# EAGLE board IR_CHR_LINSW_J002947Arevs (EAGLE 6.4), part 1 of 3
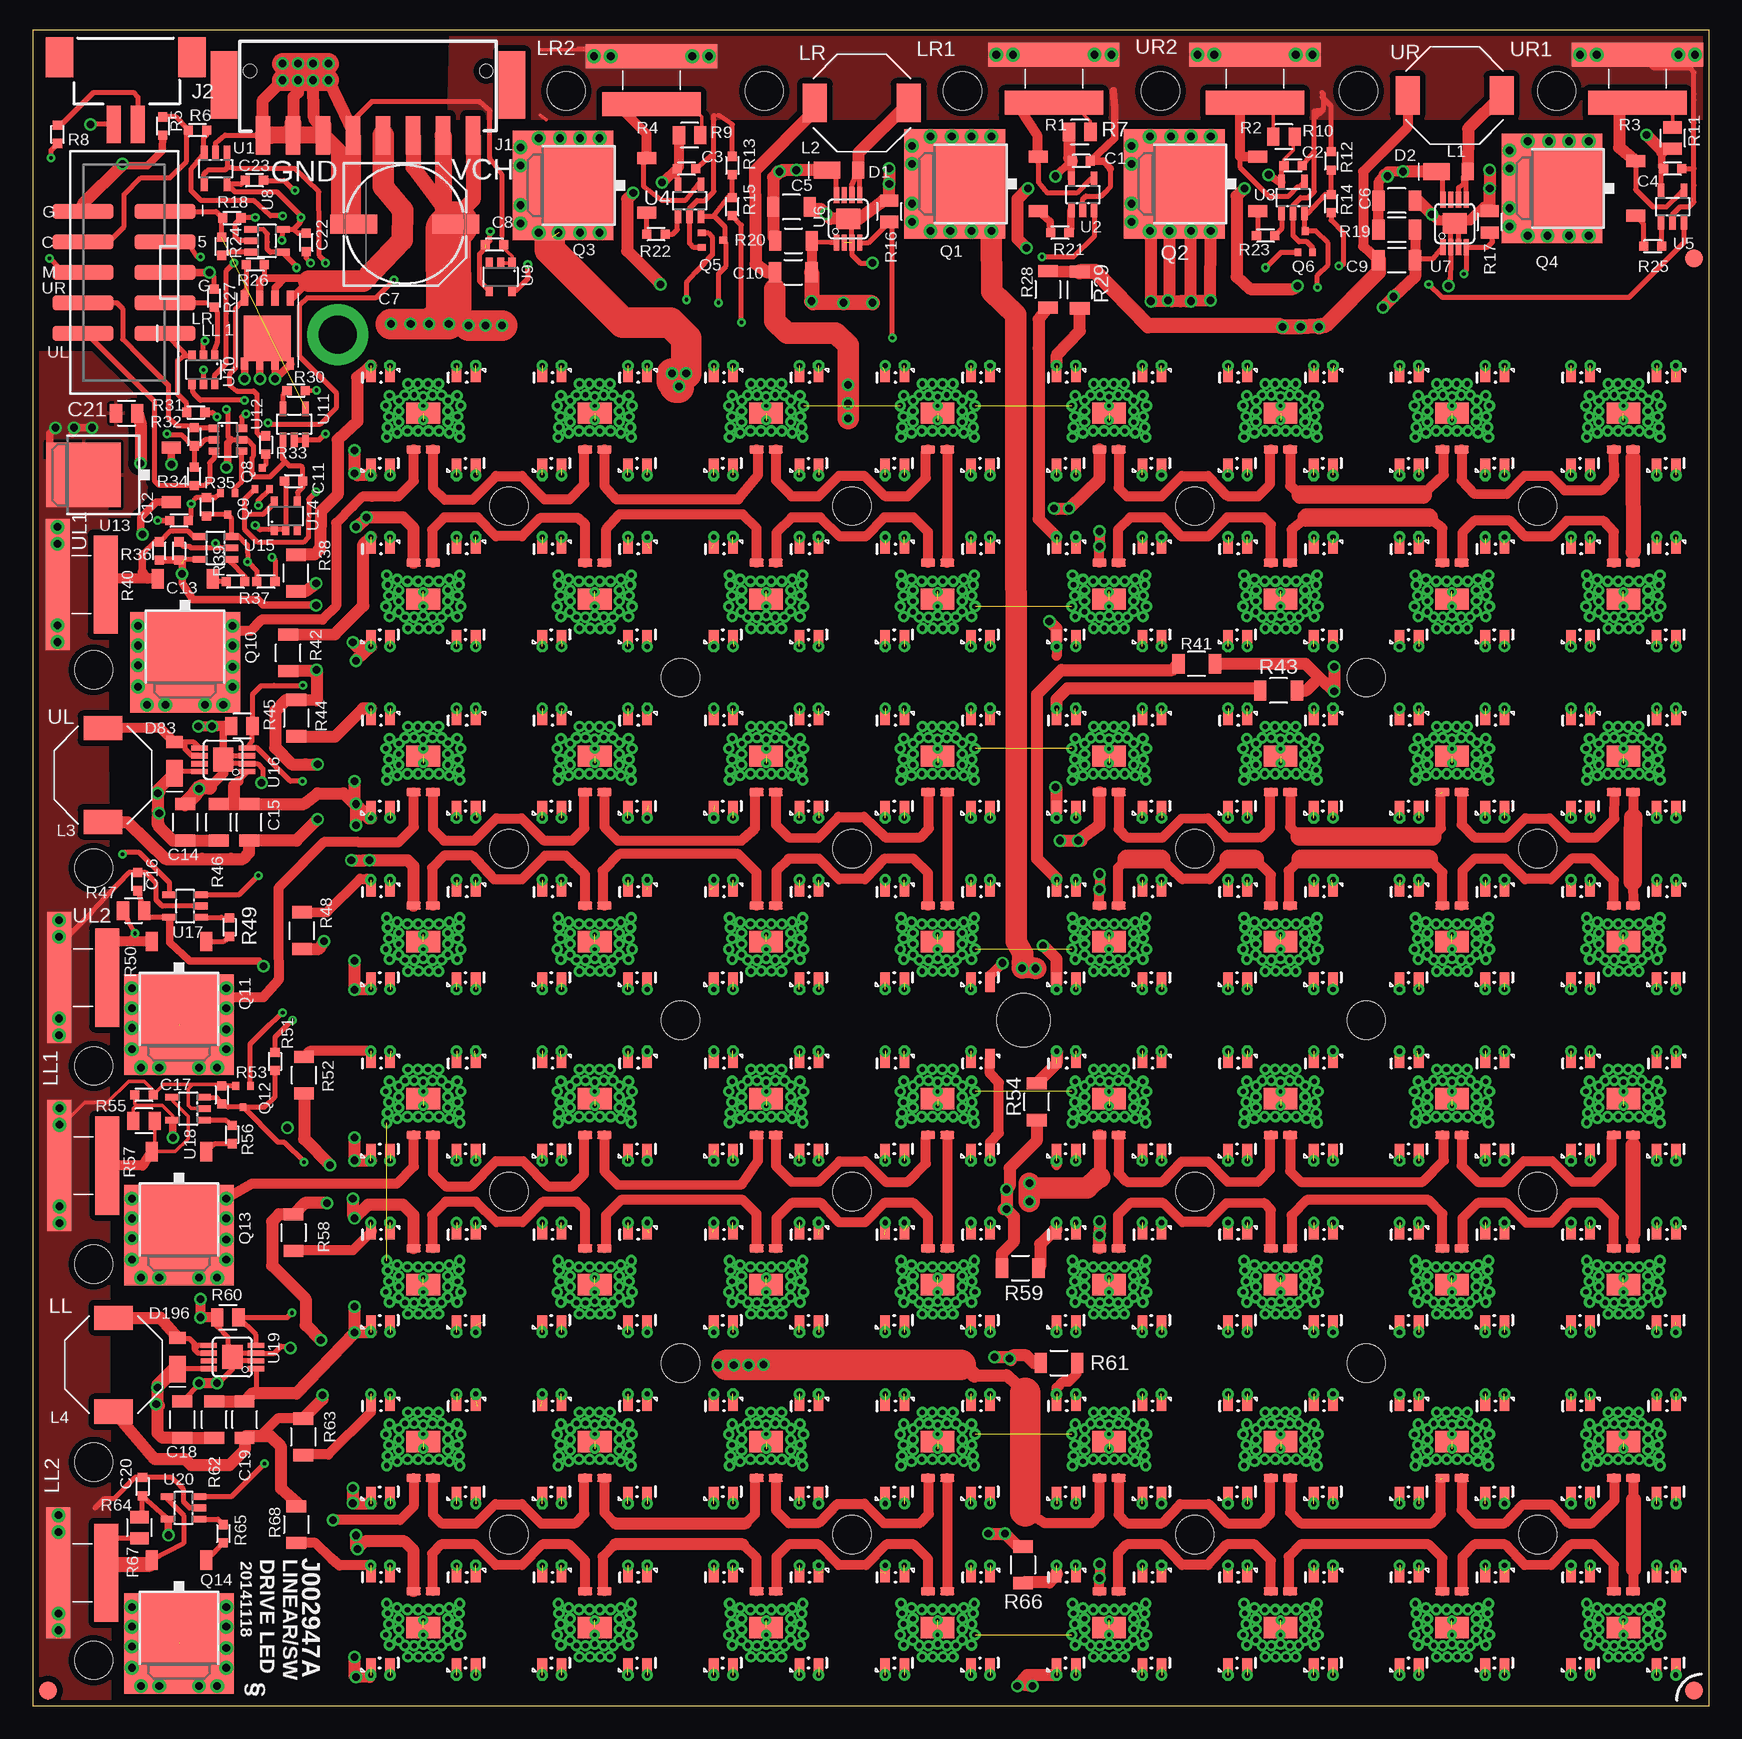
[diagram p5: board, top side]
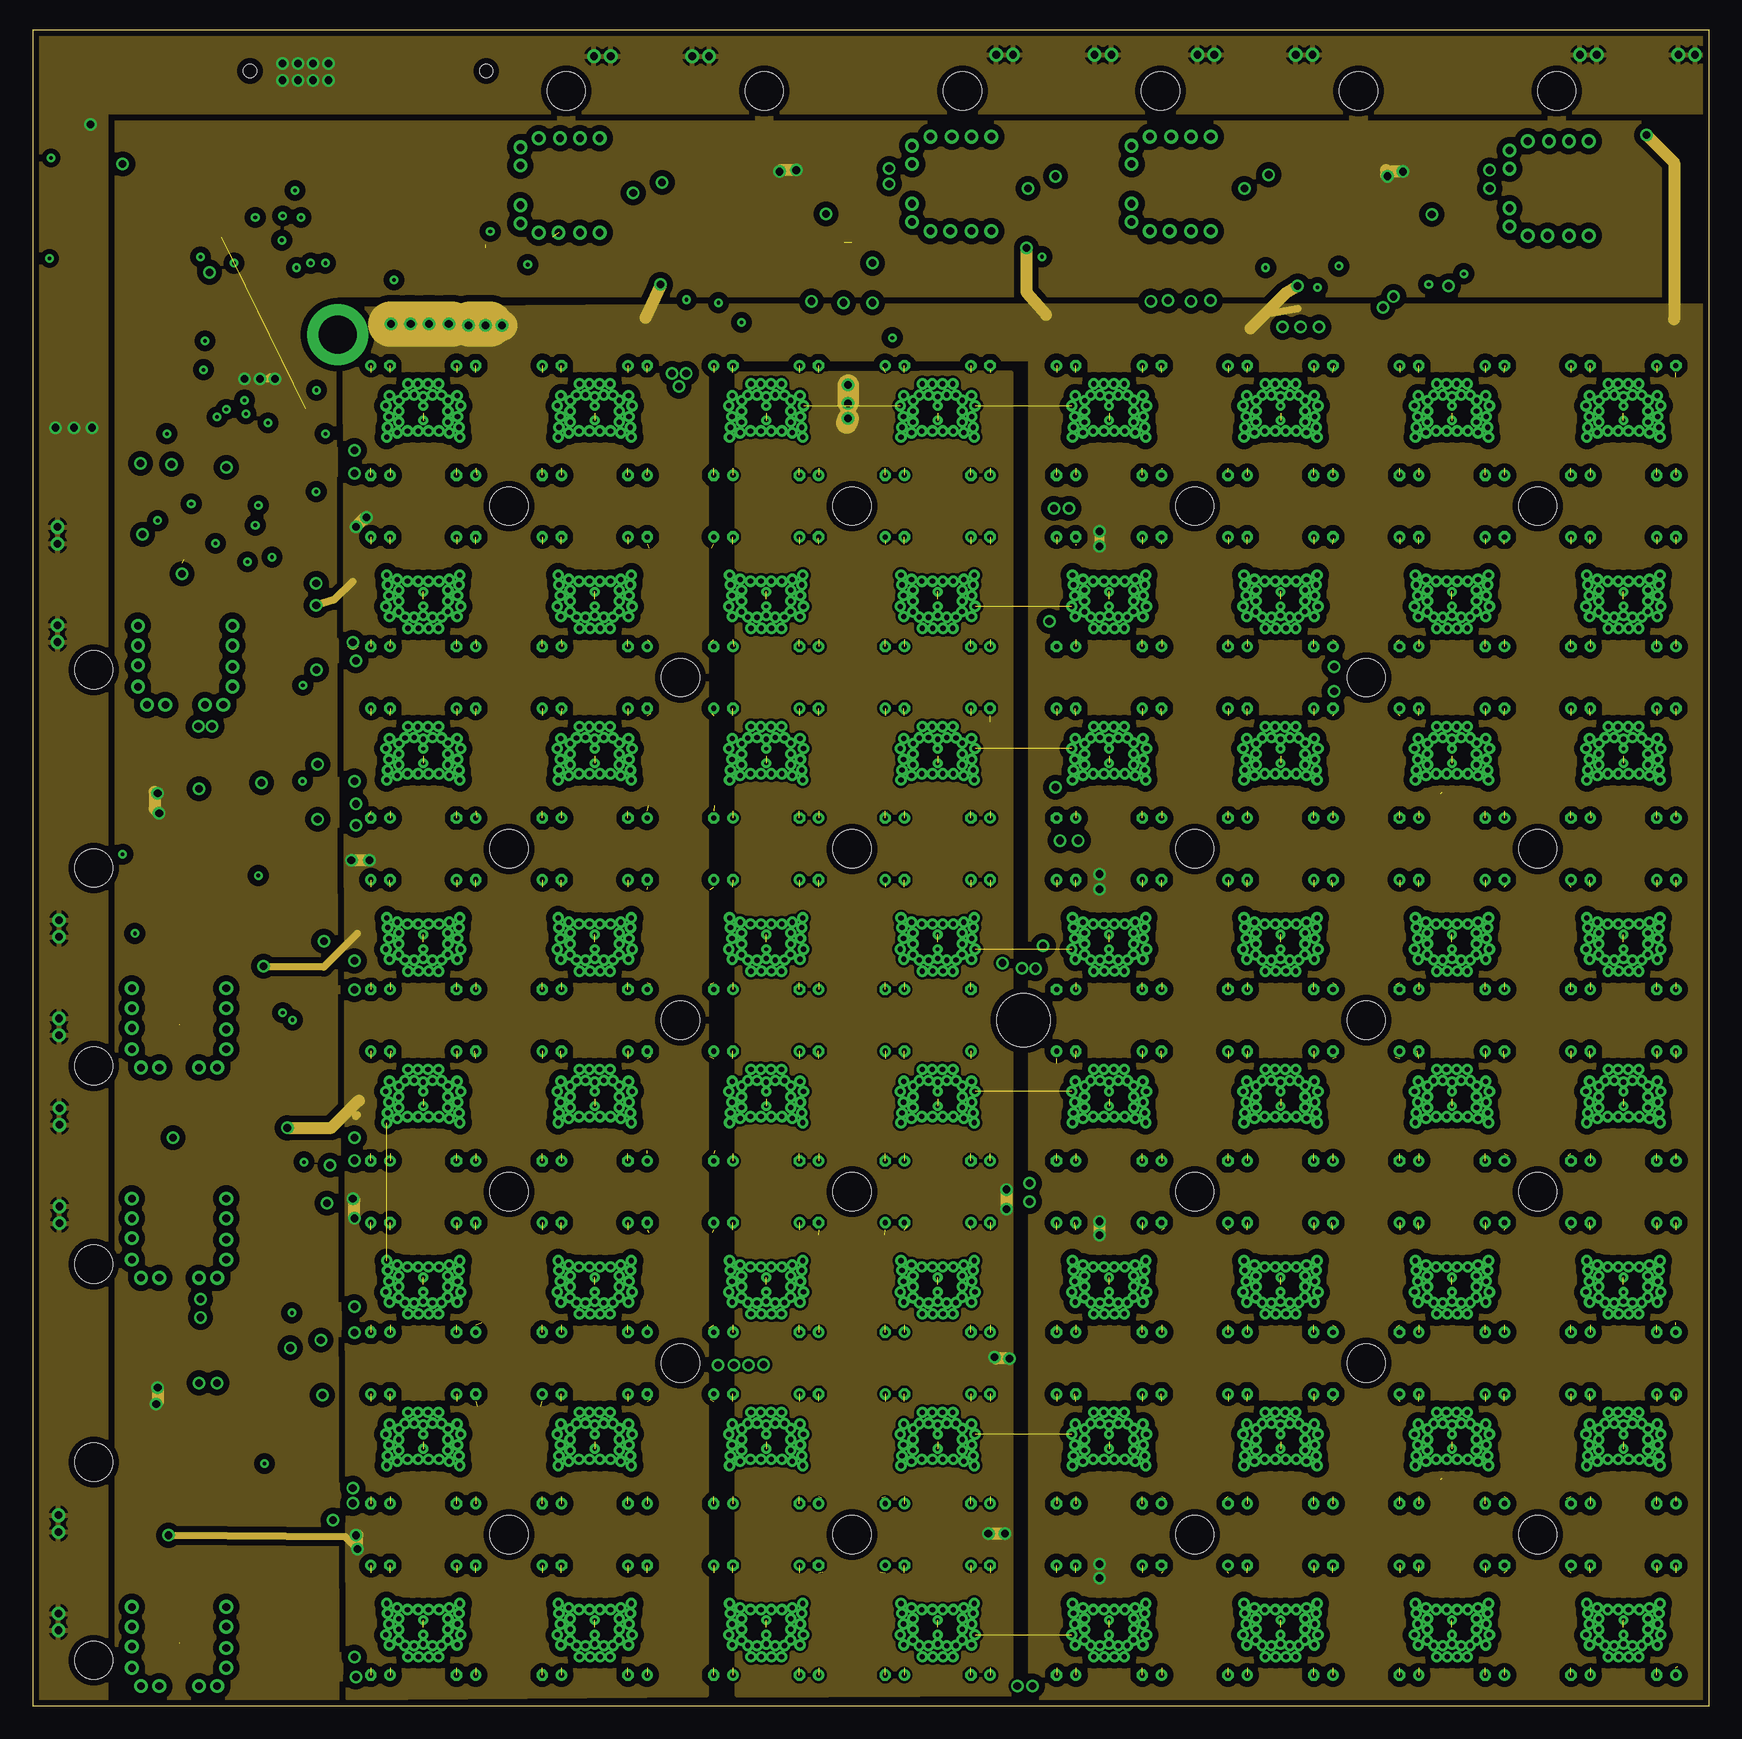
[diagram p6: board, inner layer Route2]
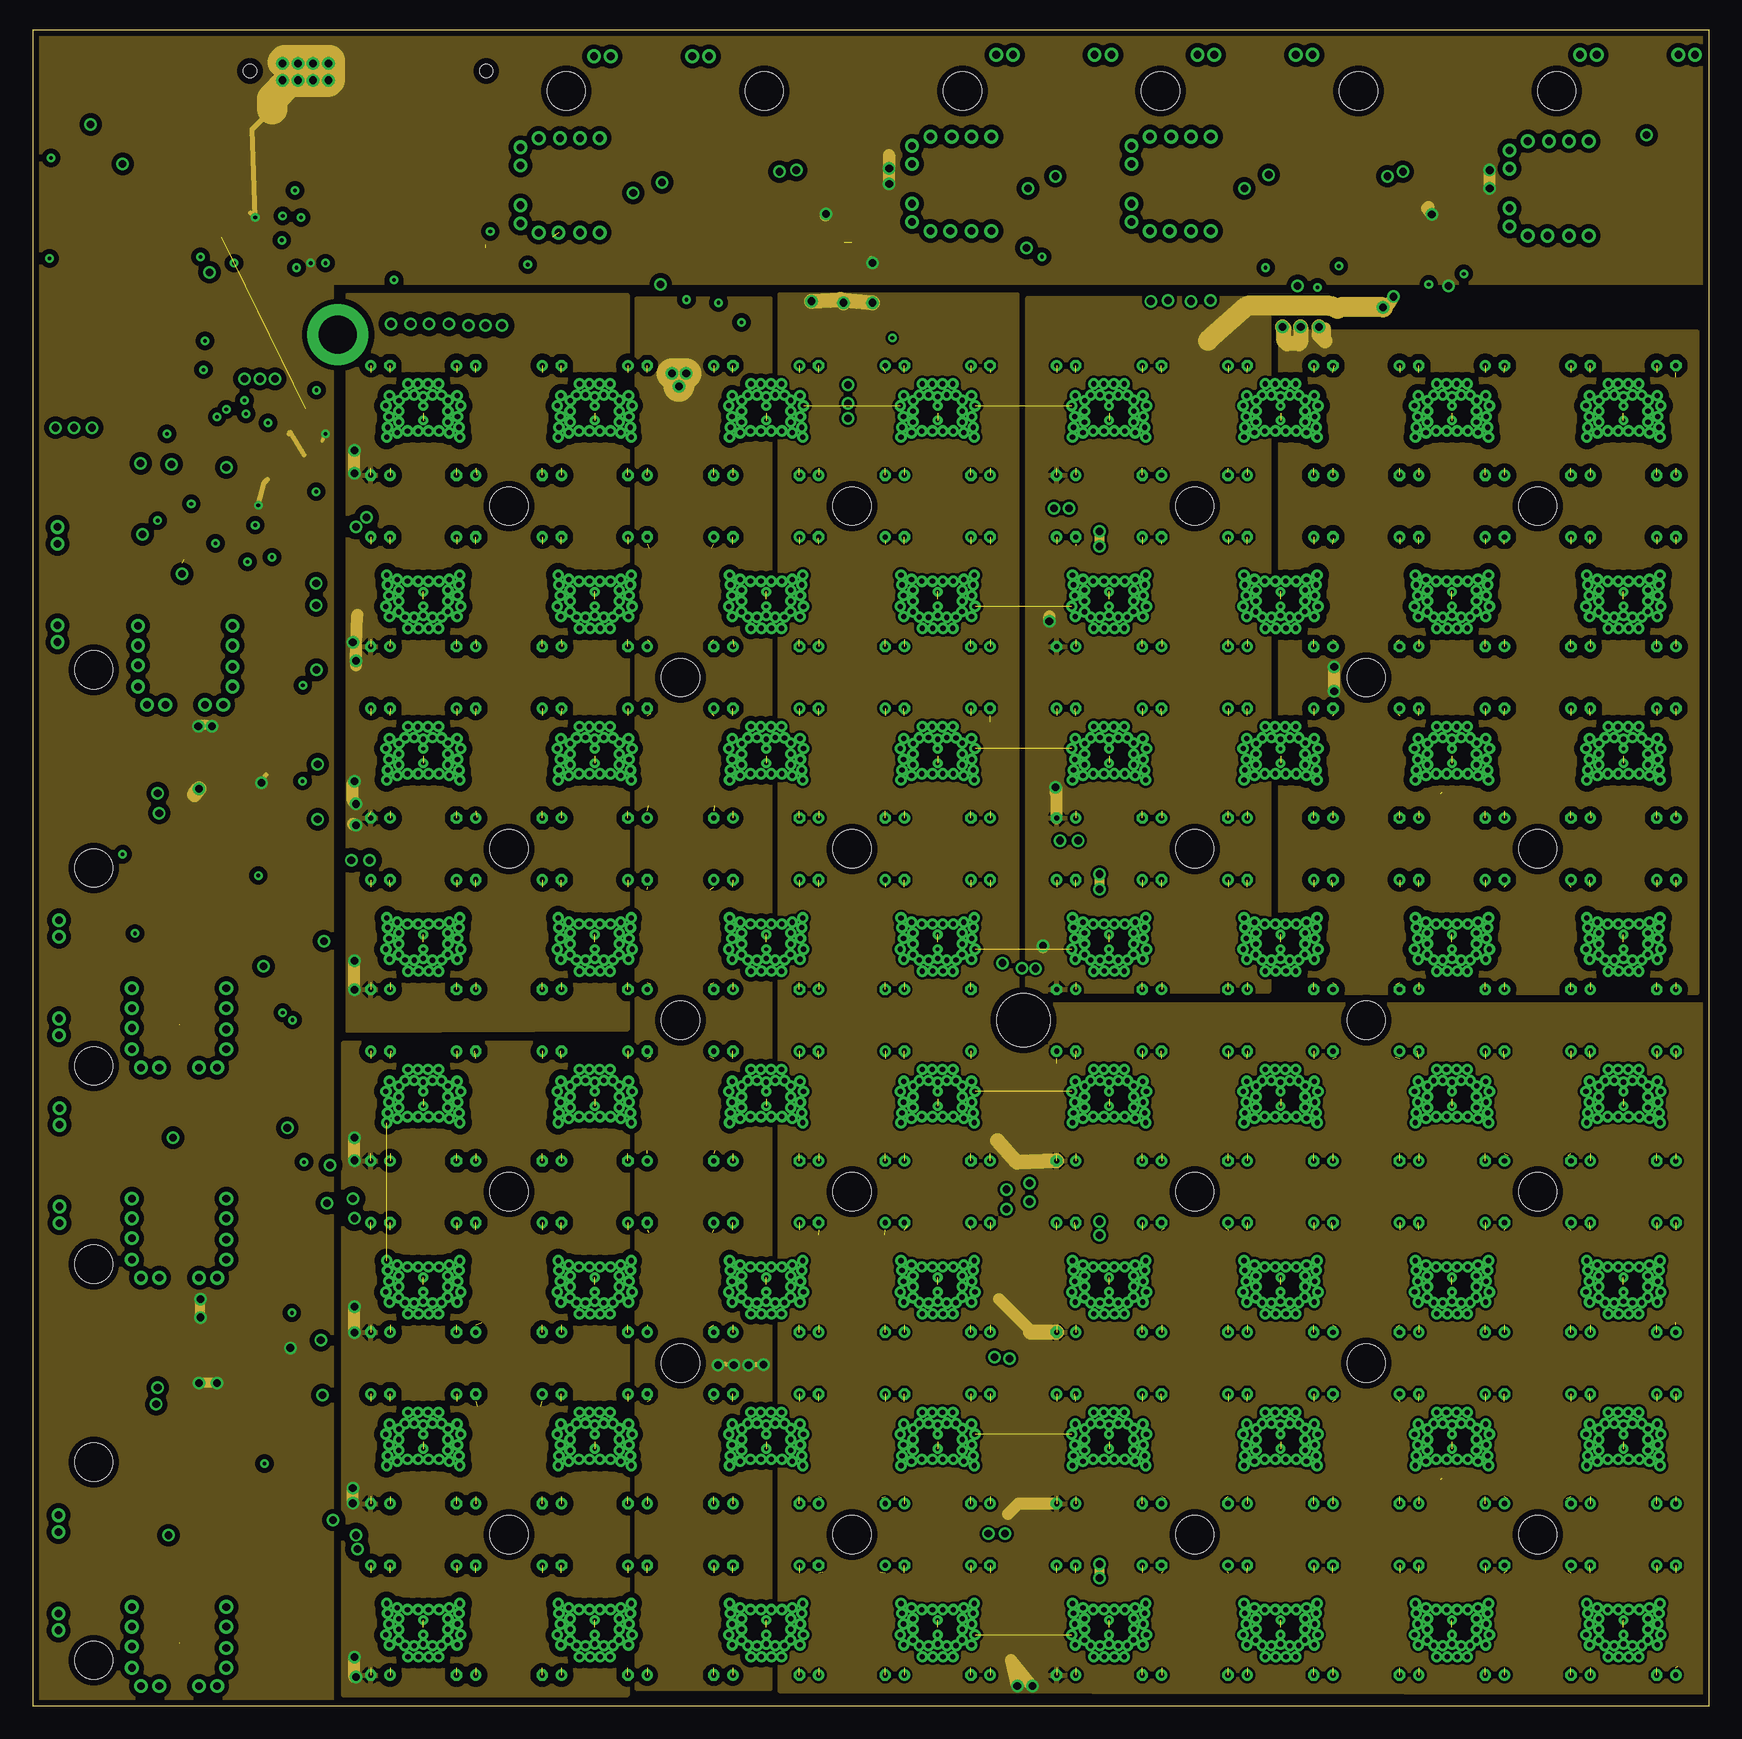
[diagram p7: board, inner layer Route3]
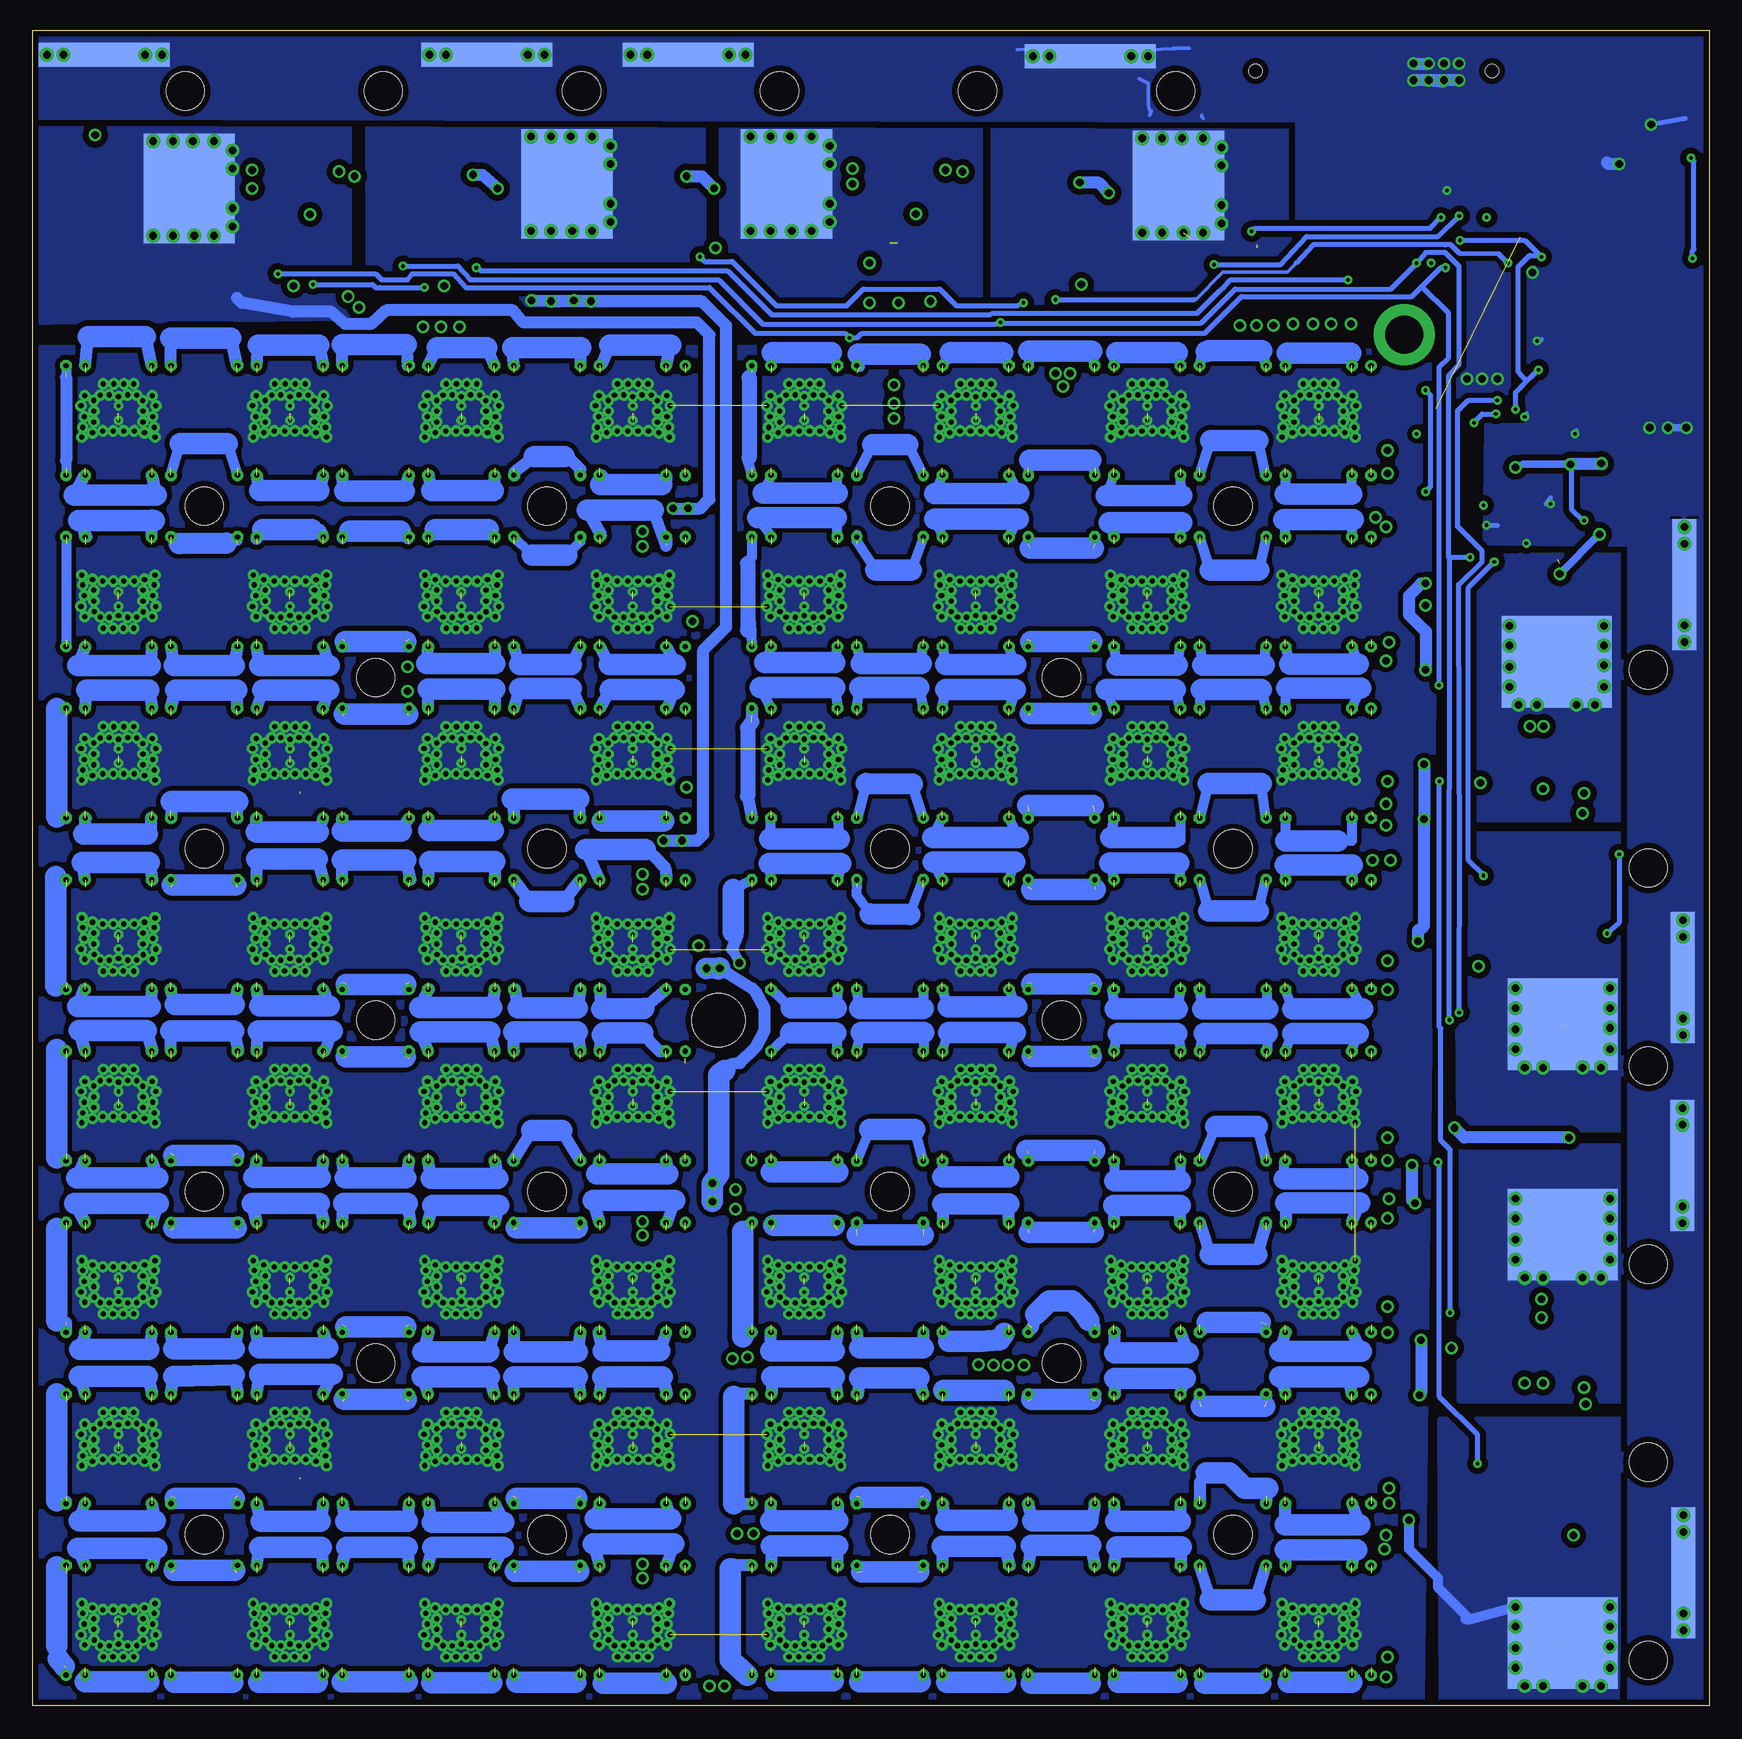
[diagram p8: board, bottom side, seen from below]

Size 139.7 x 139.7 mm. Coordinates in mm from the lower left corner, seen from the top.
Outline: 0,0 139.7,0 139.7,139.7 0,139.7 0,0
Copper layers (1*2+3*16): Top 0.068mm / dielectric 0.45mm / Route2 0.068mm / dielectric 0.45mm / Route3 0.068mm / dielectric 0.45mm / Bottom 0.068mm
Design rules "default *": minimum track width 10mil, minimum drill 12mil, track to track 8mil, track to pad 8mil, pad to pad 8mil, via to via 8mil, smd to smd 8mil, copper to edge 20mil, drill to drill 8mil, minimum pad ring 10mil, minimum via ring 8mil, stop-mask expansion 4mil, vias tented up to drill 0mil, thermal gap 10mil
Holes 4.45 mm at 82.55,57.15
Holes 3.17 mm at 39.69,100.01 68.26,100.01 96.84,100.01 125.41,100.01 111.12,85.72 96.84,71.44 125.41,71.44 68.26,71.44 39.69,71.44 53.98,57.15 111.12,57.15 125.41,42.86 96.84,42.86 68.26,42.86 39.69,42.86 39.69,14.29 68.26,14.29 96.84,14.29 125.41,14.29 111.12,28.57 53.98,28.57 5.08,3.81 5.08,20.32 5.08,36.83 5.08,53.34 5.08,69.85 5.08,86.36 44.45,134.62 60.96,134.62 77.47,134.62 93.98,134.62 110.49,134.62 127,134.62 53.98,85.72

## Footprints (pad centres in the part's own frame; a part is rotated, then mirrored left to right if it is on the bottom)
0603S = smd 0.762 x 0.762: 1 -0.762,0; 2 0.762,0
1206S = smd 1.016 x 1.651: 1 -1.524,0; 2 1.524,0
PANASONIC_G = smd 3.9 x 1.6: + 4.25,0; - -4.25,0
0805S = smd 1.016 x 1.524: 1 -0.889,0; 2 0.889,0
PWRDI-123 = smd 1 x 1.4: A 1.6,0 | smd 2.2 x 1.4: K -1,0
LED_SFH4050_HEAT = smd 0.8 x 1.6: A -0.8,-0.4; C 0.8,-0.4 | drill 0.432 octagon: A1 -0.8,-1 | drill 0.432: C1 0.8,-1
LED_SFH4045_HEAT_A = smd 0.8 x 1.6: A -0.8,-0.4; C 0.8,-0.4 | drill 0.432 octagon: A1 -0.8,-1
LED_SFH4050_HEAT_C = smd 0.8 x 1.6: A -0.8,-0.4; C 0.8,-0.4 | drill 0.432: C1 0.8,-1
FIDUCIAL-1.5X3 = smd 1.5 x 1.5: 1 0,0
PHOENIX1778829 = smd 1.2 x 3.2: 1 -8.75,5.35; 2 -6.25,5.35; 3 -3.75,5.35; 4 -1.25,5.35; 5 1.25,5.35; 6 3.75,5.35; 7 6.25,5.35; 8 8.75,5.35 | smd 2.2 x 5.6: PA -12,1.15; PB 12,1.15 | hole 1.1: -9.85,0; 9.85,0
DF3-2_RA = smd 3.1 x 1.2: 1 0,-1; 2 0,1 | smd 3.3 x 2.3: A 5.6,5.52; B 5.6,-5.52
2X5-SHROUDED_SMD_3M = smd 5.08 x 1.27: 1 -3.429,5.08; 2 3.429,5.08; 3 -3.429,2.54; 4 3.429,2.54; 5 -3.429,0; 6 3.429,0; 7 -3.429,-2.54; 8 3.429,-2.54; 9 -3.429,-5.08; 10 3.429,-5.08
SRU8043 = smd 2.007 x 3.2: 1 -3.912,0; 2 3.912,0
OG_LED_W0603_EVEN_12 = smd 0.67 x 1.2: A 2.421,0.8; C 2.421,-0.8 | smd 1.774 x 2.8: TH1 -0.599,0 | drill 0.432 pad 0.914: TH@38 1.397,3.048; TH@39 0.581,2.971; TH@40 -0.319,2.85; TH@41 -0.769,2.05; TH@42 0.131,2.05; TH@43 1.031,2.171; TH@44 -2.057,2.819; TH@45 -1.219,3.116; TH@46 -1.674,2.054; TH@47 -2.108,1.524; TH@48 -2.134,0.762; TH@49 -1.989,0; TH@50 -3.039,0.399; TH@51 -3.048,1.27; TH@52 0.881,1.31; TH@53 0.881,0.43; TH@56 1.397,-3.048; TH@57 0.581,-2.971; TH@58 -0.319,-2.85; TH@59 -0.769,-2.05; TH@60 0.131,-2.05; TH@61 1.031,-2.171; TH@62 -2.057,-2.819; TH@63 -1.219,-3.116; TH@64 -1.649,-2.029; TH@65 -2.108,-1.524; TH@66 -2.134,-0.762; TH@67 -3.039,-0.45; TH@68 -3.048,-1.27; TH@69 0.881,-1.31; TH@70 0.881,-0.43 | drill 0.305 pad 0.4: TH@54 0.006,0; TH@55 -1.214,0
TO252_HS = smd 1 x 1.6: 1 -2.28,-6.07; 2 2.28,-6.07 | smd 9.144 x 8.382: 3 0,0.889 | smd 9.144 x 7.62 bottom: 3S 0,0.849 | drill 0.635: P$1 -3.937,-0.508; P$2 -3.937,1.27; P$3 -3.937,2.921; P$4 -3.937,-2.159; P$5 3.937,2.921; P$6 3.937,1.143; P$7 3.937,-0.508; P$8 3.937,-2.159; P$9 -3.175,4.445; P$10 3.175,4.445; P$11 -1.651,4.445; P$12 1.651,4.445
SC-70 = smd 0.559 x 0.66: 1 -0.61,-0.889; 2 0.61,-0.889; 3 0,0.889
SO-8POWERPAK = smd 1.27 x 0.61: 1 -2.667,1.905; 2 -2.667,0.635; 3 -2.667,-0.635; 4 -2.667,-1.905 | smd 1.016 x 0.61: 5 2.794,-1.905; 6 2.794,-0.635; 7 2.794,0.635; 8 2.794,1.905 | smd 3.81 x 3.912: 9 0.686,0
2512WIDE_HS1 = smd 10.922 x 2: 1 0,2 | drill 0.635: 1A -3.4,2; 1A1 -4.797,2; 1B 3.4,2; 1B1 4.797,2 | smd 10.922 x 2 bottom: 1C 0,2 | smd 8.2 x 2: 2 0,-2
SOT23-5 = smd 0.55 x 1.2: 1 -0.95,-1.3; 2 0,-1.3; 3 0.95,-1.3; 4 0.95,1.3; 5 -0.95,1.3
MSOP8-EP = smd 0.44 x 1.35: 1 -0.976,-1.975; 2 -0.326,-1.975; 3 0.324,-1.975; 4 0.974,-1.975; 5 0.974,1.975; 6 0.324,1.975; 7 -0.326,1.975; 8 -0.975,1.975 | smd 2 x 1.7: EP 0,0
SOT23-5' = smd 0.6 x 0.9: 1 -0.95,-1.15; 2 0,-1.15; 3 0.95,-1.15; 4 0.95,1.15; 5 -0.95,1.15
SOT23-6 = smd 0.6 x 0.9: 1 -0.95,-1.15; 2 0,-1.15; 3 0.95,-1.15; 4 0.95,1.15; 5 0,1.15; 6 -0.95,1.15
SOT23-5L = smd 0.55 x 1.2: 1 -0.95,-1.3; 2 0,-1.3; 3 0.95,-1.3; 4 0.95,1.3; 5 -0.95,1.3
TO252 = smd 1 x 1.6: 1 -2.28,-4.8; 2 2.28,-4.8 | smd 5.4 x 6.2: 3 0,2.5

## Placement (x,y rotation side)
C1  0.1  [0603S]  87.38,128.78 0 top
C2  0.1  [0603S]  105.03,128.4 0 top
C3  0.1  [0603S]  54.48,128.14 0 top
C4  0.1  [0603S]  136.65,128.14 0 top
C5  10@50  [1206S]  63.22,124.94 0 top
C6  10@50  [1206S]  113.67,125.48 0 top
C7  [PANASONIC_G]  31.01,123.51 0 top
C8  0.1  [0603S]  38.48,121.79 0 top
C9  2.2@50  [1206S]  113.67,120.52 180 top
C10  2.2@50  [1206S]  63.37,119.51 180 top
C11  0.1  [0603S]  21.74,102.11 180 top
C12  0.1  [0603S]  12.19,98.81 0 top
C13  0.1  [0603S]  12.19,96.27 90 top
C14  10@50  [1206S]  12.7,73.66 90 top
C15  2.2@50  [1206S]  18.03,73.66 270 top
C16  0.1  [0603S]  8.76,68.71 90 top
C17  0.1  [0603S]  9.27,50.93 0 top
C18  10@50  [1206S]  12.45,23.88 90 top
C19  2.2@50  [1206S]  17.65,23.88 270 top
C20  0.1  [0603S]  9.14,18.29 90 top
C21  10  [0805S]  7.82,107.75 180 top
C22  0.1  [0603S]  22.78,122 270 top
C23  0.1  [0603S]  18.47,127.18 0 top
D1  DLFS240L  [PWRDI-123]  67.18,128.02 0 top
D2  DLFS240L  [PWRDI-123]  117.98,127.89 0 top
D3  [LED_SFH4050_HEAT]  28.97,110.73 180 top
D4  [LED_SFH4050_HEAT]  36.12,110.73 180 top
D5  [LED_SFH4050_HEAT]  43.26,110.73 180 top
D6  [LED_SFH4050_HEAT]  50.4,110.73 180 top
D7  [LED_SFH4050_HEAT]  57.55,110.73 180 top
D8  [LED_SFH4050_HEAT]  64.69,110.73 180 top
D9  [LED_SFH4050_HEAT]  71.83,110.73 180 top
D10  [LED_SFH4050_HEAT]  78.98,110.73 180 top
D11  [LED_SFH4050_HEAT]  86.12,110.73 180 top
D12  [LED_SFH4050_HEAT]  93.27,110.73 180 top
D13  [LED_SFH4050_HEAT]  100.41,110.73 180 top
D14  [LED_SFH4050_HEAT]  107.55,110.73 180 top
D15  [LED_SFH4050_HEAT]  114.7,110.73 180 top
D16  [LED_SFH4050_HEAT]  121.84,110.73 180 top
D17  [LED_SFH4050_HEAT]  128.98,110.73 180 top
D18  [LED_SFH4050_HEAT]  136.13,110.73 180 top
D19  [LED_SFH4050_HEAT]  28.97,103.58 0 top
D20  [LED_SFH4050_HEAT]  36.12,103.58 0 top
D21  [LED_SFH4050_HEAT]  43.26,103.58 0 top
D22  [LED_SFH4050_HEAT]  50.4,103.58 0 top
D23  [LED_SFH4050_HEAT]  57.55,103.58 0 top
D24  [LED_SFH4050_HEAT]  64.69,103.58 0 top
D25  [LED_SFH4050_HEAT]  71.83,103.58 0 top
D26  [LED_SFH4050_HEAT]  78.98,103.58 0 top
D27  [LED_SFH4050_HEAT]  86.12,103.58 0 top
D28  [LED_SFH4050_HEAT]  93.27,103.58 0 top
D29  [LED_SFH4050_HEAT]  100.41,103.58 0 top
D30  [LED_SFH4050_HEAT]  107.55,103.58 0 top
D31  [LED_SFH4050_HEAT]  114.7,103.58 0 top
D32  [LED_SFH4050_HEAT]  121.84,103.58 0 top
D33  [LED_SFH4050_HEAT]  128.98,103.58 0 top
D34  [LED_SFH4050_HEAT]  136.13,103.58 0 top
D35  [LED_SFH4050_HEAT]  28.97,96.44 180 top
D36  [LED_SFH4050_HEAT]  36.12,96.44 180 top
D37  [LED_SFH4050_HEAT]  43.26,96.44 180 top
D38  [LED_SFH4050_HEAT]  50.4,96.44 180 top
D39  [LED_SFH4050_HEAT]  57.55,96.44 180 top
D40  [LED_SFH4050_HEAT]  64.69,96.44 180 top
D41  [LED_SFH4050_HEAT]  71.83,96.44 180 top
D42  [LED_SFH4050_HEAT]  78.98,96.44 180 top
D43  [LED_SFH4050_HEAT]  86.12,96.44 180 top
D44  [LED_SFH4050_HEAT]  93.27,96.44 180 top
D45  [LED_SFH4050_HEAT]  100.41,96.44 180 top
D46  [LED_SFH4050_HEAT]  107.55,96.44 180 top
D47  [LED_SFH4050_HEAT]  114.7,96.44 180 top
D48  [LED_SFH4050_HEAT]  121.84,96.44 180 top
D49  [LED_SFH4050_HEAT]  128.98,96.44 180 top
D50  [LED_SFH4050_HEAT]  136.13,96.44 180 top
D51  [LED_SFH4050_HEAT]  28.97,89.3 0 top
D52  [LED_SFH4050_HEAT]  36.12,89.3 0 top
D53  [LED_SFH4050_HEAT]  43.26,89.3 0 top
D54  [LED_SFH4050_HEAT]  50.4,89.3 0 top
D55  [LED_SFH4050_HEAT]  57.55,89.3 0 top
D56  [LED_SFH4050_HEAT]  64.69,89.3 0 top
D57  [LED_SFH4050_HEAT]  71.83,89.3 0 top
D58  [LED_SFH4050_HEAT]  78.98,89.3 0 top
D59  [LED_SFH4050_HEAT]  86.12,89.3 0 top
D60  [LED_SFH4050_HEAT]  93.27,89.3 0 top
D61  [LED_SFH4050_HEAT]  100.41,89.3 0 top
D62  [LED_SFH4050_HEAT]  107.55,89.3 0 top
D63  [LED_SFH4050_HEAT]  114.7,89.3 0 top
D64  [LED_SFH4050_HEAT]  121.84,89.3 0 top
D65  [LED_SFH4050_HEAT]  128.98,89.3 0 top
D66  [LED_SFH4050_HEAT]  136.13,89.3 0 top
D67  [LED_SFH4050_HEAT]  28.97,82.15 180 top
D68  [LED_SFH4050_HEAT]  36.12,82.15 180 top
D69  [LED_SFH4050_HEAT]  43.26,82.15 180 top
D70  [LED_SFH4050_HEAT]  50.4,82.15 180 top
D71  [LED_SFH4050_HEAT]  57.55,82.15 180 top
D72  [LED_SFH4050_HEAT]  64.69,82.15 180 top
D73  [LED_SFH4050_HEAT]  71.83,82.15 180 top
D74  [LED_SFH4050_HEAT]  78.98,82.15 180 top
D75  [LED_SFH4050_HEAT]  86.12,82.15 180 top
D76  [LED_SFH4050_HEAT]  93.27,82.15 180 top
D77  [LED_SFH4050_HEAT]  100.41,82.15 180 top
D78  [LED_SFH4050_HEAT]  107.55,82.15 180 top
D79  [LED_SFH4050_HEAT]  114.7,82.15 180 top
D80  [LED_SFH4050_HEAT]  121.84,82.15 180 top
D81  [LED_SFH4050_HEAT]  128.98,82.15 180 top
D82  [LED_SFH4050_HEAT]  136.13,82.15 180 top
D83  DLFS240L  [PWRDI-123]  11.81,78.74 90 top
D84  [LED_SFH4050_HEAT]  28.97,75.01 0 top
D85  [LED_SFH4050_HEAT]  36.12,75.01 0 top
D86  [LED_SFH4050_HEAT]  43.26,75.01 0 top
D87  [LED_SFH4050_HEAT]  50.4,75.01 0 top
D88  [LED_SFH4050_HEAT]  57.55,75.01 0 top
D89  [LED_SFH4050_HEAT]  64.69,75.01 0 top
D90  [LED_SFH4050_HEAT]  71.83,75.01 0 top
D91  [LED_SFH4050_HEAT]  78.98,75.01 0 top
D92  [LED_SFH4050_HEAT]  86.12,75.01 0 top
D93  [LED_SFH4050_HEAT]  93.27,75.01 0 top
D94  [LED_SFH4050_HEAT]  100.41,75.01 0 top
D95  [LED_SFH4050_HEAT]  107.55,75.01 0 top
D96  [LED_SFH4050_HEAT]  114.7,75.01 0 top
D97  [LED_SFH4050_HEAT]  121.84,75.01 0 top
D98  [LED_SFH4050_HEAT]  128.98,75.01 0 top
D99  [LED_SFH4050_HEAT]  136.13,75.01 0 top
D100  [LED_SFH4050_HEAT]  28.97,67.87 180 top
D101  [LED_SFH4050_HEAT]  36.12,67.87 180 top
D102  [LED_SFH4050_HEAT]  43.26,67.87 180 top
D103  [LED_SFH4050_HEAT]  50.4,67.87 180 top
D104  [LED_SFH4050_HEAT]  57.55,67.87 180 top
D105  [LED_SFH4050_HEAT]  64.69,67.87 180 top
D106  [LED_SFH4050_HEAT]  71.83,67.87 180 top
D107  [LED_SFH4050_HEAT]  78.98,67.87 180 top
D108  [LED_SFH4050_HEAT]  86.12,67.87 180 top
D109  [LED_SFH4050_HEAT]  93.27,67.87 180 top
D110  [LED_SFH4050_HEAT]  100.41,67.87 180 top
D111  [LED_SFH4050_HEAT]  107.55,67.87 180 top
D112  [LED_SFH4050_HEAT]  114.7,67.87 180 top
D113  [LED_SFH4050_HEAT]  121.84,67.87 180 top
D114  [LED_SFH4050_HEAT]  128.98,67.87 180 top
D115  [LED_SFH4050_HEAT]  136.13,67.87 180 top
D116  [LED_SFH4050_HEAT]  28.97,60.72 0 top
D117  [LED_SFH4050_HEAT]  36.12,60.72 0 top
D118  [LED_SFH4050_HEAT]  43.26,60.72 0 top
D119  [LED_SFH4050_HEAT]  50.4,60.72 0 top
D120  [LED_SFH4050_HEAT]  57.55,60.72 0 top
D121  [LED_SFH4050_HEAT]  64.69,60.72 0 top
D122  [LED_SFH4050_HEAT]  71.83,60.72 0 top
D123  [LED_SFH4045_HEAT_A]  78.98,60.72 0 top
D124  [LED_SFH4050_HEAT]  86.12,60.72 0 top
D125  [LED_SFH4050_HEAT]  93.27,60.72 0 top
D126  [LED_SFH4050_HEAT]  100.41,60.72 0 top
D127  [LED_SFH4050_HEAT]  107.55,60.72 0 top
D128  [LED_SFH4050_HEAT]  114.7,60.72 0 top
D129  [LED_SFH4050_HEAT]  121.84,60.72 0 top
D130  [LED_SFH4050_HEAT]  128.98,60.72 0 top
D131  [LED_SFH4050_HEAT]  136.13,60.72 0 top
D132  [LED_SFH4050_HEAT]  28.97,53.58 180 top
D133  [LED_SFH4050_HEAT]  36.12,53.58 180 top
D134  [LED_SFH4050_HEAT]  43.26,53.58 180 top
D135  [LED_SFH4050_HEAT]  50.4,53.58 180 top
D136  [LED_SFH4050_HEAT]  57.55,53.58 180 top
D137  [LED_SFH4050_HEAT]  64.69,53.58 180 top
D138  [LED_SFH4050_HEAT]  71.83,53.58 180 top
D139  [LED_SFH4050_HEAT_C]  78.98,53.58 180 top
D140  [LED_SFH4050_HEAT]  86.12,53.58 180 top
D141  [LED_SFH4050_HEAT]  93.27,53.58 180 top
D142  [LED_SFH4050_HEAT]  100.41,53.58 180 top
D143  [LED_SFH4050_HEAT]  107.55,53.58 180 top
D144  [LED_SFH4050_HEAT]  114.7,53.58 180 top
D145  [LED_SFH4050_HEAT]  121.84,53.58 180 top
D146  [LED_SFH4050_HEAT]  128.98,53.58 180 top
D147  [LED_SFH4050_HEAT]  136.13,53.58 180 top
D148  [LED_SFH4050_HEAT]  28.97,46.43 0 top
D149  [LED_SFH4050_HEAT]  36.12,46.43 0 top
D150  [LED_SFH4050_HEAT]  43.26,46.43 0 top
D151  [LED_SFH4050_HEAT]  50.4,46.43 0 top
D152  [LED_SFH4050_HEAT]  57.55,46.43 0 top
D153  [LED_SFH4050_HEAT]  64.69,46.43 0 top
D154  [LED_SFH4050_HEAT]  71.83,46.43 0 top
D155  [LED_SFH4050_HEAT]  78.98,46.43 0 top
D156  [LED_SFH4050_HEAT]  86.12,46.43 0 top
D157  [LED_SFH4050_HEAT]  93.27,46.43 0 top
D158  [LED_SFH4050_HEAT]  100.41,46.43 0 top
D159  [LED_SFH4050_HEAT]  107.55,46.43 0 top
D160  [LED_SFH4050_HEAT]  114.7,46.43 0 top
D161  [LED_SFH4050_HEAT]  121.84,46.43 0 top
D162  [LED_SFH4050_HEAT]  128.98,46.43 0 top
D163  [LED_SFH4050_HEAT]  136.13,46.43 0 top
D164  [LED_SFH4050_HEAT]  28.97,39.29 180 top
D165  [LED_SFH4050_HEAT]  36.12,39.29 180 top
D166  [LED_SFH4050_HEAT]  43.26,39.29 180 top
D167  [LED_SFH4050_HEAT]  50.4,39.29 180 top
D168  [LED_SFH4050_HEAT]  57.55,39.29 180 top
D169  [LED_SFH4050_HEAT]  64.69,39.29 180 top
D170  [LED_SFH4050_HEAT]  71.83,39.29 180 top
D171  [LED_SFH4050_HEAT]  78.98,39.29 180 top
D172  [LED_SFH4050_HEAT]  86.12,39.29 180 top
D173  [LED_SFH4050_HEAT]  93.27,39.29 180 top
D174  [LED_SFH4050_HEAT]  100.41,39.29 180 top
D175  [LED_SFH4050_HEAT]  107.55,39.29 180 top
D176  [LED_SFH4050_HEAT]  114.7,39.29 180 top
D177  [LED_SFH4050_HEAT]  121.84,39.29 180 top
D178  [LED_SFH4050_HEAT]  128.98,39.29 180 top
D179  [LED_SFH4050_HEAT]  136.13,39.29 180 top
D180  [LED_SFH4050_HEAT]  28.97,32.15 0 top
D181  [LED_SFH4050_HEAT]  36.12,32.15 0 top
D182  [LED_SFH4050_HEAT]  43.26,32.15 0 top
D183  [LED_SFH4050_HEAT]  50.4,32.15 0 top
D184  [LED_SFH4050_HEAT]  57.55,32.15 0 top
D185  [LED_SFH4050_HEAT]  64.69,32.15 0 top
D186  [LED_SFH4050_HEAT]  71.83,32.15 0 top
D187  [LED_SFH4050_HEAT]  78.98,32.15 0 top
D188  [LED_SFH4050_HEAT]  86.12,32.15 0 top
D189  [LED_SFH4050_HEAT]  93.27,32.15 0 top
D190  [LED_SFH4050_HEAT]  100.41,32.15 0 top
D191  [LED_SFH4050_HEAT]  107.55,32.15 0 top
D192  [LED_SFH4050_HEAT]  114.7,32.15 0 top
D193  [LED_SFH4050_HEAT]  121.84,32.15 0 top
D194  [LED_SFH4050_HEAT]  128.98,32.15 0 top
D195  [LED_SFH4050_HEAT]  136.13,32.15 0 top
D196  DLFS240L  [PWRDI-123]  12.06,29.08 90 top
D197  [LED_SFH4050_HEAT]  28.97,25 180 top
D198  [LED_SFH4050_HEAT]  36.12,25 180 top
D199  [LED_SFH4050_HEAT]  43.26,25 180 top
D200  [LED_SFH4050_HEAT]  50.4,25 180 top
D201  [LED_SFH4050_HEAT]  57.55,25 180 top
D202  [LED_SFH4050_HEAT]  64.69,25 180 top
D203  [LED_SFH4050_HEAT]  71.83,25 180 top
D204  [LED_SFH4050_HEAT]  78.98,25 180 top
D205  [LED_SFH4050_HEAT]  86.12,25 180 top
D206  [LED_SFH4050_HEAT]  93.27,25 180 top
D207  [LED_SFH4050_HEAT]  100.41,25 180 top
D208  [LED_SFH4050_HEAT]  107.55,25 180 top
D209  [LED_SFH4050_HEAT]  114.7,25 180 top
D210  [LED_SFH4050_HEAT]  121.84,25 180 top
D211  [LED_SFH4050_HEAT]  128.98,25 180 top
D212  [LED_SFH4050_HEAT]  136.13,25 180 top
D213  [LED_SFH4050_HEAT]  28.97,17.86 0 top
D214  [LED_SFH4050_HEAT]  36.12,17.86 0 top
D215  [LED_SFH4050_HEAT]  43.26,17.86 0 top
D216  [LED_SFH4050_HEAT]  50.4,17.86 0 top
D217  [LED_SFH4050_HEAT]  57.55,17.86 0 top
D218  [LED_SFH4050_HEAT]  64.69,17.86 0 top
D219  [LED_SFH4050_HEAT]  71.83,17.86 0 top
D220  [LED_SFH4050_HEAT]  78.98,17.86 0 top
D221  [LED_SFH4050_HEAT]  86.12,17.86 0 top
D222  [LED_SFH4050_HEAT]  93.27,17.86 0 top
D223  [LED_SFH4050_HEAT]  100.41,17.86 0 top
D224  [LED_SFH4050_HEAT]  107.55,17.86 0 top
D225  [LED_SFH4050_HEAT]  114.7,17.86 0 top
D226  [LED_SFH4050_HEAT]  121.84,17.86 0 top
D227  [LED_SFH4050_HEAT]  128.98,17.86 0 top
D228  [LED_SFH4050_HEAT]  136.13,17.86 0 top
D229  [LED_SFH4050_HEAT]  28.97,10.72 180 top
D230  [LED_SFH4050_HEAT]  36.12,10.72 180 top
D231  [LED_SFH4050_HEAT]  43.26,10.72 180 top
D232  [LED_SFH4050_HEAT]  50.4,10.72 180 top
D233  [LED_SFH4050_HEAT]  57.55,10.72 180 top
D234  [LED_SFH4050_HEAT]  64.69,10.72 180 top
D235  [LED_SFH4050_HEAT]  71.83,10.72 180 top
D236  [LED_SFH4050_HEAT]  78.98,10.72 180 top
D237  [LED_SFH4050_HEAT]  86.12,10.72 180 top
D238  [LED_SFH4050_HEAT]  93.27,10.72 180 top
D239  [LED_SFH4050_HEAT]  100.41,10.72 180 top
D240  [LED_SFH4050_HEAT]  107.55,10.72 180 top
D241  [LED_SFH4050_HEAT]  114.7,10.72 180 top
D242  [LED_SFH4050_HEAT]  121.84,10.72 180 top
D243  [LED_SFH4050_HEAT]  128.98,10.72 180 top
D244  [LED_SFH4050_HEAT]  136.13,10.72 180 top
D245  [LED_SFH4050_HEAT]  28.97,3.57 0 top
D246  [LED_SFH4050_HEAT]  36.12,3.57 0 top
D247  [LED_SFH4050_HEAT]  43.26,3.57 0 top
D248  [LED_SFH4050_HEAT]  50.4,3.57 0 top
D249  [LED_SFH4050_HEAT]  57.55,3.57 0 top
D250  [LED_SFH4050_HEAT]  64.69,3.57 0 top
D251  [LED_SFH4050_HEAT]  71.83,3.57 0 top
D252  [LED_SFH4050_HEAT]  78.98,3.57 0 top
D253  [LED_SFH4050_HEAT]  86.12,3.57 0 top
D254  [LED_SFH4050_HEAT]  93.27,3.57 0 top
D255  [LED_SFH4050_HEAT]  100.41,3.57 0 top
D256  [LED_SFH4050_HEAT]  107.55,3.57 0 top
D257  [LED_SFH4050_HEAT]  114.7,3.57 0 top
D258  [LED_SFH4050_HEAT]  121.84,3.57 0 top
D259  [LED_SFH4050_HEAT]  128.98,3.57 0 top
D260  [LED_SFH4050_HEAT]  136.13,3.57 0 top
FID1  FIDUCIAL1.5X3  [FIDUCIAL-1.5X3]  138.43,1.27 0 top
FID2  FIDUCIAL1.5X3  [FIDUCIAL-1.5X3]  138.43,120.65 0 top
FID3  FIDUCIAL1.5X3  [FIDUCIAL-1.5X3]  1.27,1.27 0 top
J1  [PHOENIX1778829]  27.94,136.27 180 top
J2  [DF3-2_RA]  7.75,131.83 90 top
JP1  M05X22X5_SM_3M  [2X5-SHROUDED_SMD_3M]  7.6,119.49 180 top
L1  68uH/1A  [SRU8043]  118.49,134.24 0 top
L2  68uH/1A  [SRU8043]  69.09,133.6 0 top
L3  68uH/1A  [SRU8043]  5.84,77.6 90 top
L4  68uH/1A  [SRU8043]  6.73,28.45 90 top
LED1  [OG_LED_W0603_EVEN_12]  32.54,107.16 270 top
LED2  [OG_LED_W0603_EVEN_12]  46.83,107.16 270 top
LED3  [OG_LED_W0603_EVEN_12]  61.12,107.16 270 top
LED4  [OG_LED_W0603_EVEN_12]  75.41,107.16 270 top
LED5  [OG_LED_W0603_EVEN_12]  89.69,107.16 270 top
LED6  [OG_LED_W0603_EVEN_12]  103.98,107.16 270 top
LED7  [OG_LED_W0603_EVEN_12]  118.27,107.16 270 top
LED8  [OG_LED_W0603_EVEN_12]  132.56,107.16 270 top
LED9  [OG_LED_W0603_EVEN_12]  32.54,92.87 90 top
LED10  [OG_LED_W0603_EVEN_12]  46.83,92.87 90 top
LED11  [OG_LED_W0603_EVEN_12]  61.12,92.87 90 top
LED12  [OG_LED_W0603_EVEN_12]  75.41,92.87 90 top
LED13  [OG_LED_W0603_EVEN_12]  89.69,92.87 90 top
LED14  [OG_LED_W0603_EVEN_12]  103.98,92.87 90 top
LED15  [OG_LED_W0603_EVEN_12]  118.27,92.87 90 top
LED16  [OG_LED_W0603_EVEN_12]  132.56,92.87 90 top
LED17  [OG_LED_W0603_EVEN_12]  32.54,78.58 270 top
LED18  [OG_LED_W0603_EVEN_12]  46.83,78.58 270 top
LED19  [OG_LED_W0603_EVEN_12]  61.12,78.58 270 top
LED20  [OG_LED_W0603_EVEN_12]  75.41,78.58 270 top
LED21  [OG_LED_W0603_EVEN_12]  89.69,78.58 270 top
LED22  [OG_LED_W0603_EVEN_12]  103.98,78.58 270 top
LED23  [OG_LED_W0603_EVEN_12]  118.27,78.58 270 top
LED24  [OG_LED_W0603_EVEN_12]  132.56,78.58 270 top
LED25  [OG_LED_W0603_EVEN_12]  32.54,64.29 90 top
LED26  [OG_LED_W0603_EVEN_12]  46.83,64.29 90 top
LED27  [OG_LED_W0603_EVEN_12]  61.12,64.29 90 top
LED28  [OG_LED_W0603_EVEN_12]  75.41,64.29 90 top
LED29  [OG_LED_W0603_EVEN_12]  89.69,64.29 90 top
LED30  [OG_LED_W0603_EVEN_12]  103.98,64.29 90 top
LED31  [OG_LED_W0603_EVEN_12]  118.27,64.29 90 top
LED32  [OG_LED_W0603_EVEN_12]  132.56,64.29 90 top
LED33  [OG_LED_W0603_EVEN_12]  32.54,50.01 270 top
LED34  [OG_LED_W0603_EVEN_12]  46.83,50.01 270 top
LED35  [OG_LED_W0603_EVEN_12]  61.12,50.01 270 top
LED36  [OG_LED_W0603_EVEN_12]  75.41,50.01 270 top
LED37  [OG_LED_W0603_EVEN_12]  89.69,50.01 270 top
LED38  [OG_LED_W0603_EVEN_12]  103.98,50.01 270 top
LED39  [OG_LED_W0603_EVEN_12]  118.27,50.01 270 top
LED40  [OG_LED_W0603_EVEN_12]  132.56,50.01 270 top
LED41  [OG_LED_W0603_EVEN_12]  32.54,35.72 90 top
LED42  [OG_LED_W0603_EVEN_12]  46.83,35.72 90 top
LED43  [OG_LED_W0603_EVEN_12]  61.12,35.72 90 top
LED44  [OG_LED_W0603_EVEN_12]  75.41,35.72 90 top
LED45  [OG_LED_W0603_EVEN_12]  89.69,35.72 90 top
LED46  [OG_LED_W0603_EVEN_12]  103.98,35.72 90 top
LED47  [OG_LED_W0603_EVEN_12]  118.27,35.72 90 top
LED48  [OG_LED_W0603_EVEN_12]  132.56,35.72 90 top
LED49  [OG_LED_W0603_EVEN_12]  32.54,21.43 270 top
LED50  [OG_LED_W0603_EVEN_12]  46.83,21.43 270 top
LED51  [OG_LED_W0603_EVEN_12]  61.12,21.43 270 top
LED52  [OG_LED_W0603_EVEN_12]  75.41,21.43 270 top
LED53  [OG_LED_W0603_EVEN_12]  89.69,21.43 270 top
LED54  [OG_LED_W0603_EVEN_12]  103.98,21.43 270 top
LED55  [OG_LED_W0603_EVEN_12]  118.27,21.43 270 top
LED56  [OG_LED_W0603_EVEN_12]  132.56,21.43 270 top
LED57  [OG_LED_W0603_EVEN_12]  32.54,7.14 90 top
LED58  [OG_LED_W0603_EVEN_12]  46.83,7.14 90 top
LED59  [OG_LED_W0603_EVEN_12]  61.12,7.14 90 top
LED60  [OG_LED_W0603_EVEN_12]  75.41,7.14 90 top
LED61  [OG_LED_W0603_EVEN_12]  89.69,7.14 90 top
LED62  [OG_LED_W0603_EVEN_12]  103.98,7.14 90 top
LED63  [OG_LED_W0603_EVEN_12]  118.27,7.14 90 top
LED64  [OG_LED_W0603_EVEN_12]  132.56,7.14 90 top
Q1  [TO252_HS]  77.72,126.87 90 top
Q2  [TO252_HS]  96.01,126.87 90 top
Q3  [TO252_HS]  45.09,126.75 90 top
Q4  [TO252_HS]  127.51,126.49 90 top
Q5  [SC-70]  56.64,122.17 270 top
Q6  [SC-70]  106.05,122.05 0 top
Q7  MOSFET-P  [SO-8POWERPAK]  19.56,114.68 270 top
Q8  [SC-70]  19.13,102.31 0 top
Q9  [SC-70]  16.26,100.2 180 top
Q10  [TO252_HS]  12.7,87.88 180 top
Q11  [TO252_HS]  12.19,57.66 180 top
Q12  [SC-70]  17.53,50.8 180 top
Q13  [TO252_HS]  12.19,40.13 180 top
Q14  [TO252_HS]  12.19,6.1 180 top
R1  1R0  [2512WIDE_HS1]  85.09,135.64 0 top
R2  1R0  [2512WIDE_HS1]  101.85,135.64 0 top
R3  1R0  [2512WIDE_HS1]  133.73,135.64 0 top
R4  1R0  [2512WIDE_HS1]  51.56,135.51 0 top
R5  100K  [0603S]  10.84,131.68 90 top
R6  10K  [0603S]  13.73,131.35 0 top
R7  22K1  [0805S]  87.25,131.19 180 top
R8  499  [0603S]  2.06,131 270 top
R9  22K1  [0805S]  54.74,130.94 180 top
R10  22K1  [0805S]  104.27,130.81 0 top
R11  22K1  [0805S]  136.65,130.68 270 top
R12  4.99K  [0603S]  108.2,128.78 90 top
R13  4.99K  [0603S]  58.29,128.4 90 top
R14  26.1K  [0603S]  108.2,125.22 270 top
R15  26.1K  [0603S]  58.29,124.97 270 top
R16  4.99K  [0805S]  71.37,124.59 270 top
R17  4.99K  [0805S]  121.41,123.7 270 top
R18  100K  [0603S]  16.59,124.03 180 top
R19  1R00  [1206S]  113.67,123.06 180 top
R20  1R00  [1206S]  63.4,122.12 180 top
R21  4.99K  [0603S]  85.6,122.81 0 top
R22  4.99K  [0603S]  51.94,122.68 0 top
R23  4.99K  [0603S]  102.74,122.56 0 top
R24  10K  [0603S]  15.75,121.67 270 top
R25  4.99K  [0603S]  135,121.67 0 top
R26  10K  [0603S]  18.54,120.14 0 top
R27  100K  [0603S]  15.11,117.35 270 top
R28  10R0  [1206S]  84.6,118.07 90 top
R29  10R0  [1206S]  87.24,118.02 90 top
R30  10K  [0603S]  21.95,109.65 180 top
R31  100K  [0603S]  13.59,107.82 180 top
R32  100K  [0603S]  13.46,105.79 90 top
R33  10K  [0603S]  19.43,105.11 90 top
R34  100K  [0603S]  13.46,102.49 270 top
R35  4.99K  [0603S]  14.48,99.95 90 top
R36  26.1K  [0603S]  10.54,96.27 270 top
R37  26.1K  [0603S]  19.43,93.73 0 top
R38  10R0  [1206S]  21.93,94.43 270 top
R39  4.99K  [0603S]  16.89,93.73 0 top
R40  1R0  [2512WIDE_HS1]  4.06,93.47 90 top
R41  10R0  [1206S]  97,86.87 0 top
R42  10R0  [1206S]  21.28,87.78 270 top
R43  10R0  [1206S]  103.82,84.65 0 top
R44  10R0  [1206S]  21.96,82.34 90 top
R45  4.99K  [0805S]  17.42,81.69 0 top
R46  1R00  [1206S]  15.49,73.66 270 top
R47  22K1  [0805S]  8.41,66.29 0 top
R48  10R0  [1206S]  22.43,64.63 270 top
R49  4.99K  [0603S]  16.4,64.91 90 top
R50  1R0  [2512WIDE_HS1]  4.19,60.71 90 top
R51  26.1K  [0603S]  20.19,53.72 90 top
R52  10R0  [1206S]  22.61,52.58 270 top
R53  4.99K  [0603S]  15.75,50.93 90 top
R54  10R0  [1206S]  83.66,50.36 270 top
R55  22K1  [0805S]  9.27,48.77 180 top
R56  4.99K  [0603S]  16.61,47.62 90 top
R57  1R0  [2512WIDE_HS1]  4.22,45.04 90 top
R58  10R0  [1206S]  21.73,39.45 90 top
R59  10R0  [1206S]  82.3,36.5 180 top
R60  4.99K  [0805S]  16.26,32.38 0 top
R61  10R0  [1206S]  85.52,28.59 180 top
R62  1R00  [1206S]  15.11,23.88 270 top
R63  10R0  [1206S]  22.54,22.43 90 top
R64  22K1  [0805S]  8.89,14.86 90 top
R65  4.99K  [0603S]  15.88,14.35 90 top
R66  10R0  [1206S]  82.52,11.76 90 top
R67  1R0  [2512WIDE_HS1]  4.14,11.1 90 top
R68  10R0  [1206S]  21.96,15.12 90 top
U1  AD8613  [SOT23-5]  15.24,128.14 180 top
U2  AD8613  [SOT23-5]  87.5,125.98 0 top
U3  AD8613  [SOT23-5]  105.03,125.73 0 top
U4  AD8613  [SOT23-5]  54.74,125.48 0 top
U5  AD8613  [SOT23-5]  136.65,124.97 0 top
U6  AL8807  [MSOP8-EP]  67.94,123.95 0 top
U7  AL8807  [MSOP8-EP]  118.49,123.57 0 top
U8  AD8613  [SOT23-5]  19.51,122.13 270 top
U9  LM26  [SOT23-5']  38.99,119.13 180 top
U10  74DUAL14  [SOT23-6]  14.22,111.38 180 top
U11  MAX9064  [SOT23-5L]  21.79,106.83 0 top
U12  74DUAL14  [SOT23-6]  16.26,105.54 270 top
U13  7805DT  [TO252]  6.73,102.62 90 top
U14  LM26  [SOT23-5']  21.08,99.19 0 top
U15  AD8613  [SOT23-5]  15.24,96.52 90 top
U16  AL8807  [MSOP8-EP]  15.88,78.87 90 top
U17  AD8613  [SOT23-5]  12.7,66.67 90 top
U18  AD8613  [SOT23-5]  12.95,49.78 90 top
U19  AL8807  [MSOP8-EP]  16.64,29.08 90 top
U20  AD8613  [SOT23-5]  12.57,16.51 90 top

## Tracks (layer width: path | path; a pad name or v marks a point on that pad's centre or on a via)
5V  (via drill 0.3, 0.64)  (1 unrouted)
  Top 0.305: 37.97,117.79 U9.4
  Top 0.406: 37.72,121.54 37.21,121.03 37.21,118.8 U9.4 | 10.54,98.81 C12.1 10.54,98.81 | v16.13,108.08 16.13,107.95 16.26,107.82 16.26,107.19 16.26,105.79 16.51,105.54 U12.5 17.91,105.54 18.41,105.03 18.41,104.27 18.29,104.01 18.29,102.64 18.44,102.44 19.76,102.44 21.01,103.68 20.83,103.91 | v14.22,111.38 U10.5 | 16.84,126.21 U1.5 17.37,126.84 C23.1 | 16.84,126.21 16.87,126.21 | v13.97,120.78 13.72,120.78 12.95,121.92 11.14,121.92 JP1.7 | 16.84,126.21 20.35,126.21 22.23,124.33 22.23,123.57 | 22.23,123.57 22.1,123.44 | 22.1,123.44 21.72,123.06 | 21.72,123.06 20.82,123.06 U8.5 20.81,122.95 v20.75,122.17 | C8.1 38.1,122.12 v38.12,122.91 | v22.35,124.08 22.35,123.83 22.23,123.57 | 22.23,123.57 22.1,123.44 | 20.83,103.91 21.36,103.38 22.33,103.38 22.45,103.25 22.45,102.16 C11.1 22.5,101.6 22.07,101.17 22.07,100.38 U14.4 | 20.83,103.91 20.83,105.59 U11.1 | 10.54,98.81 v10.41,98.81 | C22.1 22.12,122.76 21.72,123.06
  Top 0.61: U13.2 11.53,103.66 v11.56,103.5 | v16.13,103.25 16.26,103.12 16.26,105.28 16.51,105.54
  Top 1.016: C21.1 8.99,106.76 v8.99,103.58
  Bottom 0.406: v16.13,108.08 16.13,109.47 | 16.13,109.47 14.86,110.74 v14.22,111.38 | 17.65,122.17 17.4,122.17 | 17.4,122.17 15.37,122.17 v13.97,120.78 14.1,120.9 14.99,120.9 15.93,119.96 15.93,111.23 15.19,110.44 16.13,109.47 | v20.75,122.17 17.65,122.17 | 17.65,122.17 17.4,122.17 | v38.12,122.91 37.9,123.17 37.16,123.17 23.24,123.17 v22.35,124.08 | v10.41,98.81 10.54,98.81 11.43,99.69 11.43,103.38 v11.56,103.5
  Bottom 0.61: v11.56,103.5 15.49,103.5 v16.13,103.25
  Bottom 1.016: v8.99,103.58 8.94,103.5 v11.56,103.5
CHR_BRIGHT
  Top 0.406: JP1.8 6.33,122.03 7.62,123.32 7.62,125.98 9.02,127.38 11.43,127.38 12.83,128.78 12.83,131.21 | 12.83,131.21 R6.1 | 12.83,131.21 12.83,131.57 11.94,132.46 10.86,132.46 R5.2
CHR_IN  (via drill 0.3)
  Top 0.406: R6.2 14.49,130.95 14.22,130.68 14.22,129.51 U1.3 13.21,128.11 13.21,126.29 14.02,125.48 18.41,125.48 19.81,124.21 v20.83,124.21 | U9.5 40.25,117.98 41.27,119 41.25,120.02 v41.25,120.14
  Bottom 0.406: v41.25,120.14 35.69,120.14 33.55,122.48 22.63,122.48 v20.83,124.21
CHR_LEVEL  (via drill 0.3)
  Top 0.406: U1.1 16.19,128.2 | 16.19,128.2 16,128.02 14.61,128.02 14.48,127.89 14.22,127.64 14.22,126.91 U1.4 | R51.2 20.19,55.75 21.59,57.15 v21.64,57.17 | v19.94,95.76 20.19,95.5 R37.2 | R14.2 108.2,123.83 109.22,122.81 109.22,120.14 v108.84,120.02 | v59.05,115.32 59.05,123.44 R15.2 | v24.38,120.27 24.38,120.4 23.88,120.9 23.88,123.01 23.85,126.21 21.84,128.14 19.05,128.14 16.76,128.14 16.7,128.2 16.19,128.2
  Bottom 0.406: v21.64,57.17 21.61,95.58 | 21.61,95.58 21.72,95.76 | 21.72,95.76 v19.94,95.76 | v108.84,120.02 104.27,120.02 103.25,118.87 82.68,118.87 82.55,118.87 78.87,115.19 59.44,115.19 59.21,115.26 | 59.21,115.26 v59.05,115.32 | 59.21,115.26 42.34,115.26 40.01,117.6 39.5,118.11 26.54,118.11 v24.38,120.27 23.62,121.16 22,121.16 20.83,119.99 20.83,111.78 21.72,110.87 21.72,95.76 | 21.61,95.58 21.72,95.76
IGND  (via drill 0.3, 0.64)  (1 unrouted)
  Top 0.406: U16.3 15.93,79.19 15.88,79.25 | U16.EP 16.2,78.54 U16.2 18.74,78.54 19.18,78.11 19.18,77.22 v19.05,76.96 | 12.45,25.53 C18.2 13.97,26.92 v15.37,26.92 14.99,26.92 15.49,26.92 16.64,28.07 U19.EP | U19.2 16.96,28.76 U19.EP | U19.3 18.42,29.41 | 18.42,29.41 16.96,29.41 | 16.96,29.41 U19.EP | R60.1 15.37,31.62 16.26,30.73 16.26,30.11 16.96,29.41 | 115.32,125.48 115.44,125.48 v116.59,124.33 | U7.3 118.81,123.37 U7.EP 118.17,123.25 U7.2 118.17,120.32 118.11,119 v117.98,118.36 | U6.EP 68.27,123.63 U6.3 68.27,120.96 68.96,120.27 v69.98,120.27 | 18.42,29.41 20.14,29.41 20.7,29.97 21.46,29.97 v21.46,29.84 | U8.2 17.19,122.13 16.89,122.43 16.89,123.57 R18.1 | R18.1 17.4,124.08 | 17.4,124.08 R18.1 | R18.1 17.27,123.95 R18.1 | Q8.2 19.76,101.4 18.77,100.43 v18.8,100.08 | U11.2 U11.3 | U11.2 22.48,105.54 | 22.48,105.54 U11.2 | 17.4,124.08 18.16,124.08 v18.54,124.08 | 22.48,105.54 23.88,105.54 v24.38,106.05 | C22.2 22.78,120.7 22.96,120.42 23.19,120.29 | 23.19,120.29 23.19,120.27 | 23.19,120.27 23.19,120.29 | 23.19,120.29 v23.16,120.27 | v23.16,120.27 23.19,120.29 | 23.19,120.29 23.19,120.27 | 23.19,120.27 23.19,120.29 | 23.19,120.29 v23.16,120.27
  Top 0.61: U16.EP 15.88,79.25 15.88,80.39 15.88,81.15 15.88,81.53 R45.1
  Top 0.813: U16.EP 15.88,77.72 14.73,76.58 | C6.2 115.32,125.48 115.44,125.48 v116.59,124.33 117.09,123.83 118.36,123.83 | 118.36,123.83 U7.EP | 118.36,123.83 119.76,123.83 120.9,124.97 121.28,124.97 R17.1 | R45.1 15.34,81.66 v14.94,81.66 | v14.94,81.66 13.97,81.64 | 13.97,81.64 13.74,81.64 13.92,81.66 | 13.92,81.66 v13.79,81.66 | v13.79,81.66 13.92,81.66 | 13.92,81.66 13.97,81.64 | 13.97,81.64 v14.94,81.66 | v13.79,81.66 13.92,81.66 | R60.1 14.1,32.38 | 14.1,32.38 v13.97,32.38 | v13.97,33.91 13.97,32.51 14.1,32.38 | 15.49,26.92 14.99,26.92 | 14.99,26.92 v15.37,26.92 | v13.84,26.92 14.99,26.92
  Top 1.016: R17.1 v121.41,126.49 v121.41,128.02 | C6.2 115.44,125.48 v116.59,124.33 | v71.37,128.14 71.37,127 v71.37,126.87 R16.1 70.87,125.48 68.83,123.95 U6.EP 66.5,123.95 65.84,124.61 65.08,124.61 64.9,124.79 | 64.9,124.79 C5.2 | 64.9,124.79 65.68,124.79 v66.12,124.36
  Top 1.27: 14.73,76.58 14.1,76.58 13.97,76.58 | 13.97,76.58 v13.84,76.45 | v13.84,76.45 13.46,75.95 | 13.46,75.95 13.21,75.69 C14.2 | 13.46,75.95 v13.84,76.45 | v13.84,76.45 13.97,76.58 | 13.46,75.95 v13.84,76.45
  Route3 0.305: v24.38,106.05 24.13,105.41
  Route3 0.406: v21.46,29.84 21.46,29.97 | v19.05,76.96 19.43,77.6 | v69.98,120.27 69.98,120.52 69.85,120.65 | v117.98,118.36 118.24,118.62 | v18.8,100.08 19.3,101.98 19.56,102.23 | 22.61,104.27 21.46,106.17 21.34,106.05 | 18.16,124.46 18.29,124.33 v18.54,124.08 18.29,131.44 19.94,133.1 | 20.45,133.6 20.57,133.73 20.45,133.6
  Route3 0.813: v14.94,81.66 14.22,81.79 v13.79,81.66 | v13.97,32.38 v13.97,33.91 | v15.37,26.92 v13.84,26.92
  Route3 1.016: v121.41,126.49 v121.41,128.02 | v116.59,124.33 116.2,124.84 116.33,124.97 | v71.37,126.87 71.37,129.29 v71.37,128.14 | v66.12,124.36 66.12,124.31 66.06,124.26
  Route3 1.27: v13.84,76.45 13.46,75.95
  Route3 2.54: 19.94,133.1 19.94,133.99 21.34,135.38 24.64,135.38 24.77,135.51 24.77,137.16 20.95,137.16 20.83,137.03
  pour Route3 (isolate 0.406, rank 2): 0.25,140.46 139.95,140.46 140.08,118.62 24.89,118.62 24.89,0.25 0.25,0.25
IR_BRIGHT  (1 unrouted)
  Top 0.406: JP1.9 15.29,124.57 R18.2 15.75,123.95 R24.1
IR_DRV_LL  (via drill 0.64)  (4 unrouted)
  Top 0.406: D245.A1 28.17,2.52 28.07,2.41 | U19.1 18.61,26.23 18.41,26.04
  Top 1.016: R62.1 C19.1 18.29,26.04 18.41,26.04 21.97,26.04 v26.8,31.11 26.83,31.15 D180.A1 | 28.07,2.41 v26.92,2.41 26.8,2.54 v26.8,4.06 | D213.A1 26.7,16.86 v26.67,16.89 | v26.67,18.16 26.67,17.14 | v26.8,33.27 26.8,31.24 26.92,31.11 | D148.A1 26.83,45.43 v26.8,45.47 v26.8,47.37
  Route3 1.016: v26.92,2.41 26.8,2.41 v26.8,4.06 | v26.67,16.89 v26.67,18.16 | v26.8,31.11 v26.8,33.27 | v26.8,45.47 v26.8,47.37
  pour Route3 (isolate 0.508): 25.91,0.89 25.91,55.24 49.53,55.24 49.53,0.89
IR_DRV_LR  (via drill 0.64)  (4 unrouted)
  Top 0.406: U6.1 66.49,121.98 65.28,122 R20.1
  Top 0.813: D156.A1 85.32,45.08 | R20.1 C10.1
  Top 1.016: D253.A1 82.84,2.57 v82.04,1.65 82.3,1.78 v83.31,1.65
  Top 1.27: C10.1 v64.9,117.09 | 65.02,117.35 65.02,116.97 v67.56,116.97 v69.98,116.97
  Route3 1.016: v82.04,1.65 81.53,3.81 v83.31,1.65 | 83.15,31.15 83.15,31.27 80.52,33.91 | D221.A1 82.14,16.86 81.28,16
  Route3 1.27: D188.A1 83.15,31.15 | D156.A1 82.01,45.31 80.39,47.12 | v64.9,117.09 67.31,117.22 | 67.31,117.22 v67.56,116.97 | 67.31,117.22 v69.98,116.97
  pour Route3: 82.04,117.6 62.23,117.6 62.23,1.27 140.34,1.14 140.46,58.42 82.04,58.42
IR_DRV_UL  (via drill 0.64)  (4 unrouted)
  Top 0.406: U16.1 17.85,77.79 17.14,77.09
  Top 0.813: 17.14,77.09 16.76,76.71
  Top 1.016: R46.1 16.76,75.18 | 16.76,75.18 C15.1 18.54,75.18 22.61,75.18 23.75,76.07 25.91,76.07 27.97,74.01 | 16.76,76.71 16.76,75.18 | 27.97,74.01 D84.A1 | D116.A1 26.83,59.72 v26.8,59.69 | v26.8,62.1 26.8,59.94 26.92,59.82 | D19.A1 27.08,102.58 v26.8,102.74 v26.8,104.65 | 27.97,74.01 27.97,74.14 v26.92,75.18 | v26.8,77.09 26.8,75.31 v26.92,75.18 | v26.92,75.18 v26.92,73.41 | v26.92,87.12 D51.A1 27.02,88.3 v26.67,88.65
  Route2 1.016: v26.67,88.65 26.67,88.52
  Route3 1.016: v26.8,59.69 v26.8,62.1 | 26.92,88.39 26.92,86.74 | v26.8,102.74 v26.8,104.65 | v26.92,75.18 26.67,75.44 26.67,76.96 v26.8,77.09 | v26.92,73.41 26.8,73.41 26.67,73.53 | v26.92,87.12 27.05,90.93
  pour Route3 (isolate 0.508): 26.29,56.26 26.29,117.6 49.53,117.6 49.53,56.39
IR_DRV_UR  (via drill 0.64)  (1 unrouted)
  Top 0.406: 115.19,120.65 116.7,120.65 U7.1
  Top 0.813: D59.A1 85.32,87.53 | R19.1 115.19,120.65 C9.1
  Top 1.016: D124.A 85.32,62.25 v84.2,63.37 | D92.A 85.32,76.48 v85.22,76.58 | D59.A 85.32,89.81 v84.71,90.42 | C9.1 115.19,119.13 v113.41,117.47 v112.52,116.59
  Route3 1.016: v84.2,63.37 84.2,63.25 | D92.A1 85.32,76.07 | 85.32,76.07 85.32,76.48 v85.22,76.58 85.22,76.18 85.32,76.07 | v84.71,90.42 84.71,90.81 | v113.41,117.47 113.03,116.84 112.9,116.84 v112.52,116.59
  Route3 1.676: v112.52,116.59 108.97,116.59 108.71,116.46 108.08,116.71 101.22,116.71 97.92,113.79
  pour Route3: 82.93,117.35 103,117.35 103,59.56 82.93,59.56
IR_IN
  Top 0.406: U8.3 16.36,121.18 R24.2
IR_LEVEL  (via drill 0.3)
  Top 0.406: R17.2 121.54,122.81 121.67,122.05 121.22,121.6 U7.4 119.47,119.72 v119.25,119.38 | U19.4 18.61,30.92 R60.2 21.21,32.38 v21.59,32.77 | v71.63,114.05 71.63,123.44 R16.2 69.65,121.98 U6.4 | v21.97,119.89 21.84,120.14 U8.4 19.79,121.18 19.56,121.41 19.56,122.05 19.56,122.68 19.24,123.06 U8.1 | v22.48,77.09 21.46,77.09 18.67,79.88 17.89,79.88 U16.4 18.28,80.42 R45.2 18.31,84.33 19.02,85.04 19.91,85.04 20.09,85.06 v22.5,85.06
  Bottom 0.406: v119.25,119.38 111.12,119.38 110.62,118.87 108.46,118.87 108.08,119.38 104.65,119.38 103.63,118.24 83.31,118.24 82.93,117.86 79.5,114.43 72.01,114.43 | 72.01,114.43 v71.63,114.05 | 72.01,114.43 v71.63,114.05 | v71.63,114.05 70.99,114.05 70.61,114.43 42.04,114.43 39.5,116.97 38.99,117.47 24.77,117.47 23.94,118.3 | 23.94,118.3 22.48,119.76 22.35,119.89 v21.97,119.89 | v21.59,32.77 21.59,46.35 22.35,47.12 22.35,56.49 22.48,56.62 v22.48,77.09 | v22.5,85.06 22.48,111.63 21.72,112.37 21.72,116.08 23.94,118.3
IR_RET_LL  (via drill 0.64)
  Top 0.813: R63.2 20.4,23.95 18.92,22.48
  Top 1.016: R68.2 21.98,16.93 22.02,16.94 20.7,18.11 20.7,19.05 20.7,21.59 19.81,22.48 18.92,22.48 17.78,22.48 C19.2 17.65,21.34 16.38,20.07 13.21,20.07 12.7,20.57 10.19,20.57 L4.1 | R52.2 22.61,47.24 v24.77,45.09 | v24.51,41.91 22.67,41.91 R58.2 20.53,40.97 19.94,40.39 19.94,36.7 22.73,33.91 22.73,31.75 v24,30.48 | v24.13,25.91 24.13,25.54 R63.2
  Bottom 1.016: v24.77,45.09 24.77,42.16 v24.51,41.91 | v24,30.48 24,26.04 v24.13,25.91
IR_RET_LR  (via drill 0.64)
  Top 1.016: 61.85,118.11 C10.2 61.21,119.51 60.25,120.22 60.17,127.99 65.18,132.99 L2.1 | R59.2 80.77,37.72 81.79,38.73 81.79,40.77 v81.15,41.4 | 80.9,41.4 81.15,41.66 v81.15,43.05 81.41,43.31 81.41,44.83 83.66,47.09 R54.2 | R61.2 83.42,28.59 82.8,29.21 81.66,29.21 v81.41,28.96 | v80.14,29.08 81.28,29.08 81.53,28.83 | R66.2 82.09,13.29 v81.03,14.35 v79.63,14.35
  Top 1.778: 61.85,118.11 61.85,115.44 62.87,114.43 66.93,114.43 67.94,113.41 v67.94,110.11 67.94,108.84 | v67.94,108.58 v67.94,107.31
  Route2 1.016: v81.15,41.4 v81.15,43.05 | v81.41,28.96 80.26,28.96 v80.14,29.08 | v81.03,14.35 v79.63,14.35
  Route2 1.778: v67.94,110.11 67.94,108.71 v67.94,108.58 | v67.94,107.31 67.82,106.93
  pour Route2: 81.53,111.12 58.67,111 58.67,0.89 81.53,1.02
IR_RET_UL  (via drill 0.64)
  Top 1.016: L3.1 7.9,73.66 11.07,70.61 14.1,70.61 16.51,70.61 17.53,70.61 18.03,71.12 C15.2 21.97,72.14 v23.75,73.91 | R38.2 22.75,92.93 v23.62,93.57 | R42.2 23.29,86.26 v23.65,86.36 23.65,83.84 22.16,83.82 R44.2 21.13,83.87 20.19,82.93 20.19,79.88 21.59,78.49 22.73,78.49 v23.75,78.49 | R48.2 23.86,63.1 v24.26,63.75
  Bottom 1.016: v23.62,93.57 24,93.57 25.02,92.53 25.02,90.96 23.6,89.56 23.62,86.28 v23.65,86.36 | v23.75,78.49 v23.75,73.91 23.75,73.53 23.75,65.02 24.26,64.64 v24.26,63.75
IR_RET_UR  (via drill 0.64)
  Top 0.813: L1.1 114.58,131.6 110.87,127.89 110.87,121.67 C9.2
  Top 1.016: v108.46,86.61 v108.46,84.58 107.38,85.53 107.19,85.72 | R41.2 106.05,86.87 107.19,85.72 | R43.2 106.11,84.64 107.19,85.72 | R28.2 R29.2
  Top 1.27: C9.2 112.14,119.51 107.7,115.06 | 107.7,115.06 v105.66,114.94 | v105.66,114.94 v104.14,114.94 | v104.14,114.94 103.89,115.06 | 103.89,115.06 103.76,115.06 | 103.76,115.06 92.94,115.04 88.57,119.56 R29.2 | 107.7,115.06 107.44,115.06 v107.19,114.94 | 107.7,115.06 v105.66,114.94 | v104.14,114.94 103.89,115.06 | 103.89,115.06 103.76,115.06
  Route3 1.016: 107.7,113.79 107.7,114.81 | v108.46,84.58 v108.46,86.61
  Route3 1.27: v107.19,114.94 107.19,114.3 107.7,113.79 | v105.66,114.94 105.66,113.67 105.54,113.54 104.52,113.54 104.27,113.79 104.27,114.81 v104.14,114.94
  pour Route3 (isolate 0.508): 104.01,114.55 138.68,114.55 138.68,59.44 104.01,59.44
LGND  (via drill 0.3, 0.64)
  Top 0.305: 42.29,138.05 46.74,138.05 | 56.26,138.05 56.77,138.3 45.47,138.18 | 42.8,132.21 42.29,132.59 | U9.2 U9.1 39.94,120.84 39.62,121.16 39.12,121.67 | C8.2 39.12,121.67 | 39.12,121.67 39.12,122.56 | U18.2 13.21,49.78 12.95,50.04 12.95,51.44 13.34,51.82 13.46,51.82 | 13.46,51.82 15.62,51.82 R53.2 | 13.46,51.82 10.92,51.82 C17.2 10.03,51.31 9.27,52.07 8,52.07 6.22,50.29 4.32,50.29 2.92,48.9 2.92,45.74 R57.1C
  Top 0.406: J2.2 5.21,131.83 v4.83,131.83 | 2.54,63.75 4.83,66.04 5.33,66.67 8,69.47 C16.2 9.4,69.47 10.29,68.58 10.29,67.18 10.79,66.67 U17.2 | Q12.2 R53.2 | 5.21,16.51 5.97,17.27 6.73,17.27 8.51,19.05 C20.2 11.56,19.05 12.32,18.29 12.57,18.03 12.57,17.02 13.08,16.51 U20.2 | U5.2 136.65,124.33 137.29,124.97 138.05,124.97 138.43,125.35 138.43,126.75 138.43,128.14 | 138.43,128.14 138.43,131.95 | 138.43,131.95 138.43,133.86 138.43,134.37 138.43,136.14 138.18,136.53 135.1,136.53 R3.1C | C4.2 138.43,128.14 | 138.43,128.14 138.43,131.95 | R12.2 108.2,133.35 107.57,133.99 | C2.2 106.81,129.54 | 106.81,129.54 106.81,132.97 107.57,133.1 | 107.57,133.1 107.57,133.99 | 107.57,133.99 107.57,134.37 107.44,134.49 107.44,134.11 107.57,133.99 | Q6.2 106.66,121.56 106.17,122.05 105.54,122.05 105.03,122.56 U3.2 105.03,125.09 105.66,125.73 106.3,125.73 106.81,126.24 106.81,129.54 | 106.81,129.54 106.81,132.33 107.57,133.1 | 89.79,128.14 89.79,126.62 89.28,126.11 89.03,125.86 87.76,125.86 87.63,125.73 87.5,125.6 U2.2 | C3.2 56.77,129.41 | 56.77,129.41 56.77,132.59 56.77,132.21 56.77,129.41 | R13.2 58.29,131.83 57.15,132.59 | Q5.2 55.09,121.56 54.74,121.92 U4.2 54.74,124.84 55.37,125.48 56.01,125.48 56.77,126.24 56.77,129.41 | U1.2 15.24,130.3 16,130.94 18.82,130.94 J1.8 | C13.2 12.57,96.65 13.08,96.65 13.21,96.52 U15.2 15.62,96.52 v15.24,96.9 | C11.2 21.08,101.73 21.08,98.29 U14.2 U14.1 18.93,98.04 v18.54,98.42 | Q9.2 15.19,100.71 R35.2 13.59,100.71 v13.21,100.2 13.21,99.19 C12.2 | R31.1 14.99,107.82 v15.37,107.44 | U10.2 14.22,113.67 v14.35,113.79 | R27.1 15.11,119.13 v14.73,119.51 | 39.12,122.56 39.12,127.64 38.1,129.03 38.1,132.97 37.21,133.73 28.23,133.73 26.36,131.86
  Top 0.406: 13.46,104.9 R32.1 13.84,105.03 14.35,105.54 U12.2 | 13.46,104.9 R34.1 | 13.46,104.9 12.45,105.92 11.3,105.92 v11.18,106.05 | C23.2 19.25,127.15 20.95,127.15 21.79,126.31 v21.84,126.31
  Top 0.61: 89.79,128.14 89.28,128.78 C1.2 90.17,130.68 90.17,132.59 90.17,133.22 90.04,134.62 | R5.1 10.78,129.65 9.53,128.4 7.62,128.4 v7.49,128.52 | JP1.5 14.72,119.49 v14.73,119.51 | U13.3 3.3,102.62 1.4,104.52 1.4,106.05 v1.91,106.55 | v3.43,106.55 3.3,106.05 3.81,106.55 v4.95,106.55
  Top 1.016: JP1.10 4.17,125.21 v7.49,128.52 | 19.84,130.92 19.32,130.92 19.18,131.06 19.18,133.86 v20.83,135.51 v20.83,136.91 | v22.1,135.51 22.1,134.49 21.72,134.11 21.72,131.32 | 24.19,131.35 23.43,132.4 v23.37,135.51 | 26.8,131.06 26.67,131.19 26.36,131.86 v24.64,135.51 v24.64,136.91 | v23.37,136.91 v22.1,136.91
  Top 1.27: J1.5 26.69,124.05 C7.- | J1.6 25.46,129.68 25.45,124.05 25.97,123.51 C7.- | 25.96,123.7 C7.- | J1.7 21.34,131.3
  Top 1.422: J1.7 21.69,131.93 | 24.19,131.76 24.19,131.35 J1.6 J1.7 | J1.7 19.84,130.92 J1.8
  Top 1.778: v20.83,135.51 v24.64,135.51 | v24.64,136.91 v20.83,136.91
  Bottom 0.305: 46.74,138.05 43.31,138.18 44.7,138.18 | 57.66,138.05 46.48,138.18 | 47.5,135.64 46.74,135.25 46.74,133.48 46.61,132.97 46.48,132.97 46.61,132.59 | 42.29,132.59 42.29,132.46 42.16,132.33
  Bottom 0.406: v4.83,131.83 2.03,132.33 | 15.24,97.03 v15.24,96.9 15.11,97.03 | v13.21,100.2 13.59,100.2 | 13.59,100.2 13.21,100.71 13.59,100.2 | v15.37,107.44 15.24,107.7 15.24,107.57 | v14.35,113.79 14.1,113.79 13.97,113.92 | v18.54,98.42 17.65,98.42 | v11.18,106.05 11.18,106.17 11.05,106.3 | v21.84,126.31 21.87,126.29 22.05,126.29
  Bottom 0.61: v14.73,119.51 14.73,119.25 | v1.91,106.55 2.67,106.55 v3.43,106.55
  Bottom 1.016: v7.49,128.52 8.38,128.52 8.51,128.65 | v20.83,135.51 v22.1,135.51 | v23.37,135.51 22.23,135.38 v22.1,135.51 | v22.1,135.51 v24.64,135.51 | v24.64,136.91 v23.37,136.91
  pour Bottom (isolate 0.508): 0.25,140.34 0.25,96.9 5.33,96.77 18.67,96.9 18.52,106.81 18.52,106.76 15.11,106.76 15.11,122.43 18.41,122.43 34.29,122.3 34.29,131.98 34.04,138.94 34.04,140.46
  pour Top (isolate 0.508): 0.51,109.6 0.64,99.19 9.4,99.19 9.53,112.73 0.51,112.85
  pour Top (isolate 0.508, no thermals): 0.25,0.25 6.48,0.25 6.22,103.76 0.25,103.76
  pour Top (isolate 0.508, no thermals): 34.92,142.75 34.67,132.33 141.48,132.33 141.73,142.75
  pour Bottom (isolate 0.508, no thermals): 0.25,98.81 6.73,98.81 6.73,0.25 0.25,0.25
  pour Bottom (isolate 0.508, no thermals): 32.64,141.86 32.64,132.08 141.86,132.33 141.86,142.11
  pour Route2 (isolate 0.406): 0.25,139.83 139.32,139.83 139.32,132.84 6.1,132.84 6.1,0.25 0.25,0.25
LL
  Top 0.406: U10.3 12.57,112.53 | 12.57,112.53 12.66,112.78 JP1.1 | R31.2 12.83,108.58 12.06,109.35 12.06,112.15 12.57,112.53
LL_SD  (via drill 0.3)
  Top 0.406: Q12.1 18.11,55.17 19.79,56.84 20.32,57.33 v20.83,57.78 | v17.65,108.84 13.97,108.84 13.46,109.35 13.34,109.53 U10.4
  Bottom 0.406: v20.83,57.78 20.83,62.48 20.8,67.39 20.8,75.13 20.83,76.83 20.83,78.87 20.83,79.5 20.83,79.76 20.88,93.47 18.92,95.38 18.92,96.27 20.95,98.3 20.95,107.95 20.07,108.84 v17.65,108.84
LL_SIG  (via drill 0.3)
  Top 0.406: U18.3 15.31,50.73 R53.1 16.26,49.91 Q12.3 | U20.3 16.57,17.46 v19.3,20.19 | v22.61,45.34 20.95,46.99 20.45,46.99 Q12.3 | Q12.3 19.3,49.91 20.19,50.8 R51.1
  Bottom 0.406: v19.3,20.19 19.3,22.61 22.48,25.78 22.48,45.47 v22.61,45.34
LR
  Top 0.406: JP1.3 14.46,116.95 R27.2 15.37,116.2 15.37,113.67 15.11,112.97 U10.1
LR_SD  (via drill 0.3)
  Top 0.406: Q5.1 56.29,122.78 56.64,122.43 56.64,120.95 56.39,120.7 56.01,120.27 55.24,119.51 54.48,118.67 v54.48,117.22 | U10.6 15.17,110.93 16.13,111.89 16.13,115.32 16.13,116.08 16.13,119.63 v16.76,120.27
  Bottom 0.305: 42.93,117.22 42.8,117.22 40.51,119.51 35.18,119.51 34.42,120.27
  Bottom 0.406: v54.48,117.22 42.93,117.22 | v16.76,120.27 17.53,121.03 20.78,121.06 21.51,121.79 22.02,121.79 32.99,121.79 34.42,120.27
LR_SIG  (via drill 0.3)
  Top 0.406: R13.1 R15.1 57.91,125.73 56.77,124.21 55.72,124.18 U4.3 56.8,124.18 57.66,123.32 57.66,122.3 Q5.3 57.78,121.92 57.78,120.02 57.15,119.38 v57.15,116.97 | U2.3 88.45,122.46 86.72,120.78 84.3,120.75 v84.1,120.8
  Bottom 0.406: v84.1,120.8 83.69,120.4 83.31,120.4 81.53,120.4 81.41,120.4 77.72,116.71 71.88,116.71 70.48,118.11 64.14,118.11 62.99,116.97 62.74,116.71 57.66,116.71 v57.15,116.97
MARKER  (via drill 0.3)
  Top 0.406: JP1.6 2.56,119.49 1.4,120.78 v1.4,120.65 | v1.52,129.03 1.52,129.7 R8.2
  Bottom 0.406: v1.4,120.65 1.4,121.28 1.27,121.41 1.27,128.78 v1.52,129.03
N$1  (2 unrouted)
  Bottom 0.813: D9.A1 73.14,112.82 | 78.06,112.82 D10.C1
  Bottom 1.778: 73.14,112.82 78.06,112.82
N$2  (2 unrouted)
  Bottom 0.813: D8.A1 65.75,112.7 | 70.9,112.7 70.77,111.6 D9.C1
  Bottom 1.778: 65.75,112.7 70.9,112.7
N$3  (2 unrouted)
  Bottom 0.813: D74.C1 79.07,84.88 | 72.85,84.88 72.6,83.15 D73.A1
  Bottom 1.778: 79.07,84.88 72.85,84.88
N$4  (2 unrouted)
  Bottom 0.813: D73.C1 70.78,84.87 | 65.86,84.87 D72.A1
  Bottom 1.778: 70.78,84.87 65.86,84.87
N$5  (2 unrouted)
  Bottom 0.813: D72.C1 63.64,84.72 | 57.82,84.72 58.33,83.15 D71.A1
  Bottom 1.778: 63.64,84.72 57.82,84.72
N$6  (2 unrouted)
  Bottom 0.813: D70.C1 50.24,84.71 | 44.5,84.71 44.12,83.15 D69.A1
  Bottom 1.778: 50.24,84.71 44.5,84.71
N$7  (2 unrouted)
  Bottom 0.813: D69.C1 42.33,84.71 | 37.32,84.71 36.94,83.15 D68.A1
  Bottom 1.778: 42.33,84.71 37.32,84.71
N$8  (2 unrouted)
  Bottom 0.813: D68.C1 35.19,84.84 | 29.05,84.84 29.81,83.15 D67.A1
  Bottom 1.778: 35.19,84.84 29.05,84.84
N$9  (2 unrouted)
  Bottom 0.813: D7.A1 58.85,112.82 | 63.25,112.82 D8.C1
  Bottom 1.778: 58.85,112.82 63.25,112.82
N$10  (2 unrouted)
  Bottom 0.813: D5.A1 44.31,112.79 | 49.39,112.79 49.64,111.73 D6.C1
  Bottom 1.778: 44.31,112.79 49.39,112.79
N$11  (2 unrouted)
  Bottom 0.813: D4.A1 37.3,112.95 | 42.23,112.7 42.48,111.73 D5.C1
  Bottom 1.016: 42.23,112.7 42.12,112.7 41.91,112.9
  Bottom 1.778: 37.3,112.95 41.7,112.95 41.91,112.9
N$12  (2 unrouted)
  Bottom 0.813: D3.A1 29.88,112.74 | 35.16,112.74 35.31,111.73 D4.C1
  Bottom 1.778: 29.88,112.74 35.16,112.74
N$13  (2 unrouted)
  Bottom 0.813: D20.A1 35.32,101.03 | 29.78,101.03 29.78,102.58 D19.C1
  Bottom 1.778: 35.32,101.03 29.78,101.03
N$14  (2 unrouted)
  Bottom 0.813: D84.C1 29.77,72.1 30.94,72.1 30.94,72.09 | 35.27,72.09 35.27,74.01 D85.A1
  Bottom 1.778: 30.94,72.09 35.27,72.09
N$15  (2 unrouted)
  Bottom 0.813: D21.A1 41.54,105.47 | 37.61,105.47 37.01,102.58 D20.C1
  Bottom 1.778: 41.54,105.47 37.61,105.47
N$16  (2 unrouted)
  Bottom 0.813: D85.C1 36.98,74.07 36.94,74.06 37.34,76.88 | 41.75,76.88 42.43,74.01 D86.A1
  Bottom 1.778: 37.34,76.88 41.75,76.88
N$17  (2 unrouted)
  Bottom 0.813: D86.C1 44.06,72.14 44.77,72.14 44.51,72.41 | 49.85,72.41 D87.A1
  Bottom 1.778: 44.51,72.41 49.85,72.41
N$18  (2 unrouted)
  Bottom 0.813: D71.C1 56.57,82.71 | 51.48,82.71 51.28,83.15 D70.A1
  Bottom 1.778: 56.57,82.71 51.48,82.71
N$19  (2 unrouted)
  Bottom 0.813: D107.C1 78.31,70.23 | 72.37,70.23 D106.A1
  Bottom 1.778: 78.31,70.23 72.37,70.23
N$20  (2 unrouted)
  Bottom 0.813: D106.C1 71.03,68.49 71.06,67.63 69.91,65.99 | 66.63,65.98 65.55,68.87 D105.A1
  Bottom 1.778: 69.91,65.99 66.63,65.98
N$21  (2 unrouted)
  Bottom 0.813: D105.C1 64.65,70.33 | 57.85,70.33 D104.A1
  Bottom 1.778: 64.65,70.33 57.85,70.33
N$22  (2 unrouted)
  Bottom 0.813: D104.C1 56.75,67.63 56.47,67.63 56.47,68.04 | 51.16,68.04 51.16,68.87 D103.A1
  Bottom 1.778: 56.47,68.04 51.16,68.04
N$23  (2 unrouted)
  Bottom 0.813: D102.A1 44.06,70.6 44.18,70.6 44.18,70.25 | 49.94,70.25 49.56,68.87 D103.C1
  Bottom 1.778: 44.18,70.25 49.94,70.25
N$24  (2 unrouted)
  Bottom 0.813: D22.A1 50.24,100.87 | 43.94,100.87 D21.C1
  Bottom 1.778: 50.24,100.87 43.94,100.87
N$25  (2 unrouted)
  Bottom 0.813: D6.A1 51.46,112.92 | 56.69,112.92 56.69,111.73 D7.C1
  Bottom 1.778: 51.46,112.92 56.69,112.92
N$26  (2 unrouted)
  Bottom 0.813: D41.A1 72.76,99.04 | 79.28,99.04 78.14,97.44 D42.C1
  Bottom 1.778: 72.76,99.04 79.28,99.04
N$27  (2 unrouted)
  Bottom 0.813: D40.A1 65.47,97.36 66.48,94.69 | 69.44,94.69 71.04,97.09 71.01,97.61 D41.C1
  Bottom 1.778: 66.48,94.69 69.44,94.69
N$28  (2 unrouted)
  Bottom 0.813: D39.A1 57.59,98.93 | 64.52,98.93 D40.C1
  Bottom 1.778: 57.59,98.93 64.52,98.93
N$29  (2 unrouted)
  Bottom 0.813: D102.C1 41.68,66.25 | 37.56,66.25 36.94,68.87 D101.A1
  Bottom 1.778: 41.68,66.25 37.56,66.25
N$30  (2 unrouted)
  Bottom 0.813: D38.A1 51.33,96.5 | 56.59,96.5 56.72,97.44 D39.C1
  Bottom 1.778: 51.33,96.5 56.59,96.5
N$31  (2 unrouted)
  Bottom 0.813: D37.A1 43.93,98.63 | 49.99,98.63 D38.C1
  Bottom 1.778: 43.93,98.63 49.99,98.63
N$32  (2 unrouted)
  Bottom 0.813: D101.C1 35.32,70.09 | 29.75,70.09 29.75,68.87 D100.A1
  Bottom 1.778: 35.32,70.09 29.75,70.09
N$33  (2 unrouted)
  Bottom 0.813: D88.C1 57.59,72.41 | 64.69,72.41 63.93,74.01 D89.A1
  Bottom 1.778: 57.59,72.41 64.69,72.41
N$34  (2 unrouted)
  Bottom 0.813: D89.C1 66.43,76.85 | 70.23,76.87 71.01,74.01 D90.A1
  Bottom 1.778: 66.43,76.85 70.23,76.87
N$35  (2 unrouted)
  Bottom 0.813: D36.A1 37.55,94.66 | 41.56,94.66 D37.C1
  Bottom 1.778: 37.55,94.66 41.56,94.66
N$36  (2 unrouted)
  Bottom 0.813: D90.C1 72.51,72.26 | 78.3,72.26 78.17,74.01 D91.A1
  Bottom 1.778: 72.51,72.26 78.3,72.26
N$37  (2 unrouted)
  Bottom 0.813: D35.A1 29.64,98.9 | 35.47,98.9 35.34,97.44 D36.C1
  Bottom 1.778: 29.64,98.9 35.47,98.9
N$38  (2 unrouted)
  Bottom 0.813: D24.A1 64.53,101.06 | 57.53,101.06 58.29,102.58 D23.C1
  Bottom 1.778: 64.53,101.06 57.53,101.06